# EAGLE design blitz_rev_C (EAGLE 6.5.0)

## Sheet 1 of 6
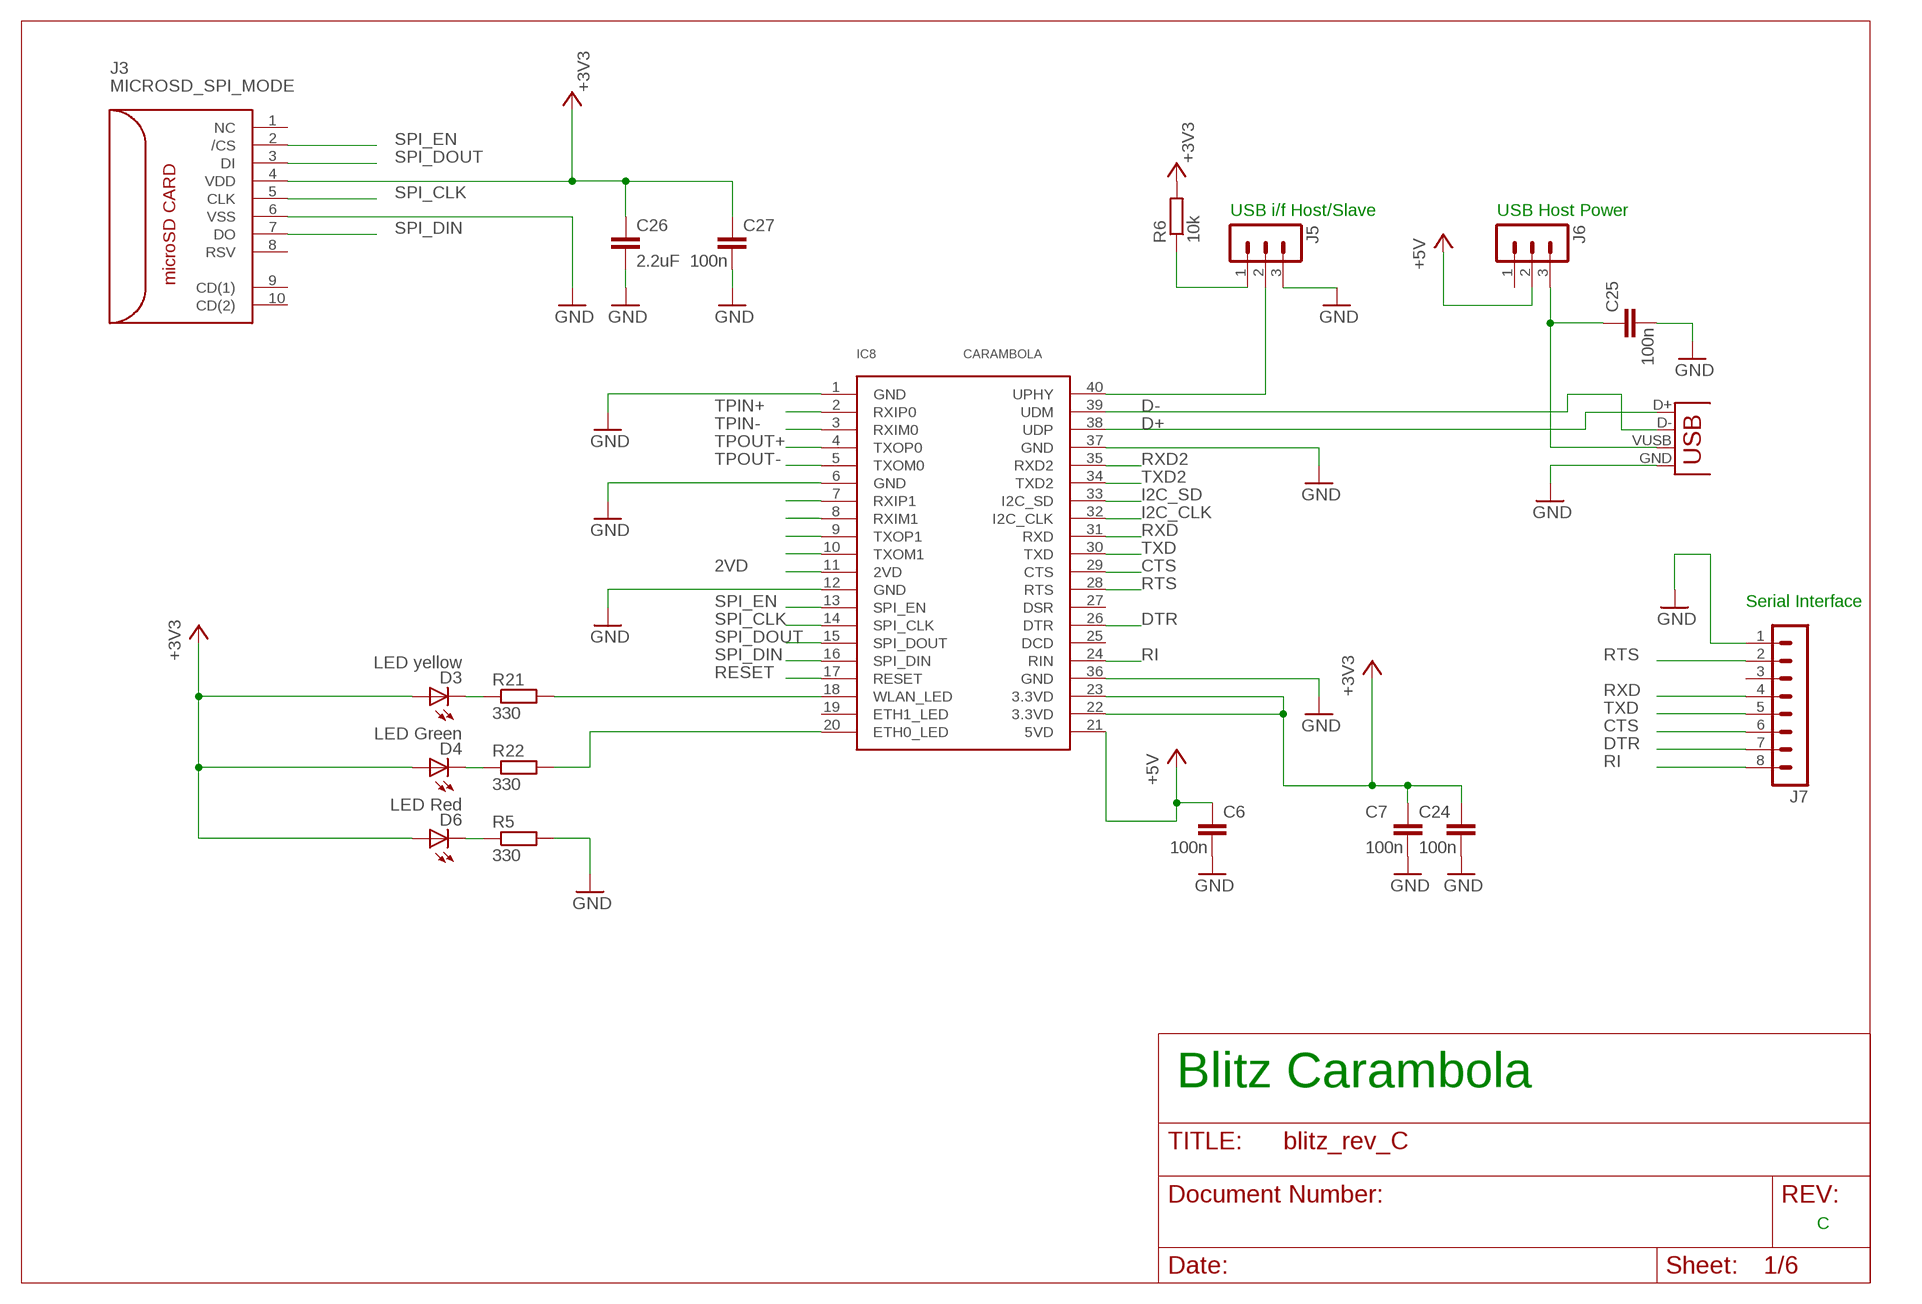
[diagram p0: schematic, sheet 1]

### Parts
C6  100n  C-EUC0805  [C0805]
C7  100n  C-EUC0805  [C0805]
C24  100n  C-EUC0805  [C0805]
C25  100n  C-EUC0805  [C0805]
C26  2.2uF  C-EUC2012  [C2012]
C27  100n  C-EUC0805  [C0805]
D3  LED yellow  LED_2012  [C2012]
D4  LED Green  LED_2012  [C2012]
D6  LED Red  LED_2012  [C2012]
IC8  CARAMBOLA  [CARAMBOLA]
J3  MICROSD_SPI_MODE  [MICRO_SD_CONNECTOR]
J4  USB-B-S  [USB-B-SMT]
J5  MA03-1  [MA03-1]
J6  MA03-1  [MA03-1]
J7  MA08-1  [MA08-1]
R5  330  R-EU_M0805  [M0805]
R6  10k  R-EU_M0805  [M0805]
R21  330  R-EU_M0805  [M0805]
R22  330  R-EU_M0805  [M0805]

### Nets
2VD: IC8.11(2VD)
+3V3: C7.1 C24.1 C26.1 C27.1 D3.1(A) D4.1(A) D6.1(A) IC8.22(3.3VD) IC8.23(3.3VD) J3.4(VDD) R6.2 ; also sheet 2,3,4,5,6
+5V: C6.1 IC8.21(5VD) J6.2 ; also sheet 2,6
CTS: IC8.29(CTS) J7.6
D+: IC8.38(UDP) J4.D+
D-: IC8.39(UDM) J4.D-
DTR: IC8.26(DTR) J7.7
GND: C6.2 C7.2 C24.2 C25.2 C26.2 C27.2 IC8.1(GND) IC8.6(GND) IC8.12(GND) IC8.36(GND) IC8.37(GND) J3.6(VSS) J4.GND J5.3 J7.1 R5.2 ; also sheet 2,3,4,5,6
I2C_CLK: IC8.32(I2C_CLK)
I2C_SD: IC8.33(I2C_SD)
N$7: J5.1 R6.1
N$8: C25.1 J4.VUSB(VBUS) J6.3
N$12: D4.2(C) R22.1
N$16: D3.2(C) R21.1
N$23: IC8.7(RXIP1)
N$24: IC8.8(RXIM1)
N$25: IC8.9(TXOP1)
N$26: IC8.10(TXOM1)
N$28: IC8.18(WLAN_LED) R21.2
N$29: IC8.20(ETH0_LED) R22.2
N$30: D6.2(C) R5.1
N$35: IC8.40(UPHY) J5.2
RESET: IC8.17(RESET)
RI: IC8.24(RIN) J7.8
RTS: IC8.28(RTS) J7.2
RXD: IC8.31(RXD) J7.4
RXD2: IC8.35(RXD2) ; also sheet 3
SPI_CLK: IC8.14(SPI_CLK) J3.5(CLK)
SPI_DIN: IC8.16(SPI_DIN) J3.7(DO)
SPI_DOUT: IC8.15(SPI_DOUT) J3.3(DI)
SPI_EN: IC8.13(SPI_EN) J3.2(/CS)
TPIN+: IC8.2(RXIP0) ; also sheet 4
TPIN-: IC8.3(RXIM0) ; also sheet 4
TPOUT+: IC8.4(TXOP0) ; also sheet 4
TPOUT-: IC8.5(TXOM0) ; also sheet 4
TXD: IC8.30(TXD) J7.5
TXD2: IC8.34(TXD2) ; also sheet 3
Unconnected: IC8.19(ETH1_LED) IC8.25(DCD) IC8.27(DSR) J3.1(NC) J3.8(RSV) J3.9(CD(1)) J3.10(CD(2)) J6.1 J7.3

### Notes on the sheet
- USB i/f Host/Slave | USB Host Power
- Serial Interface
- Blitz Carambola
- C

## Sheet 2 of 6
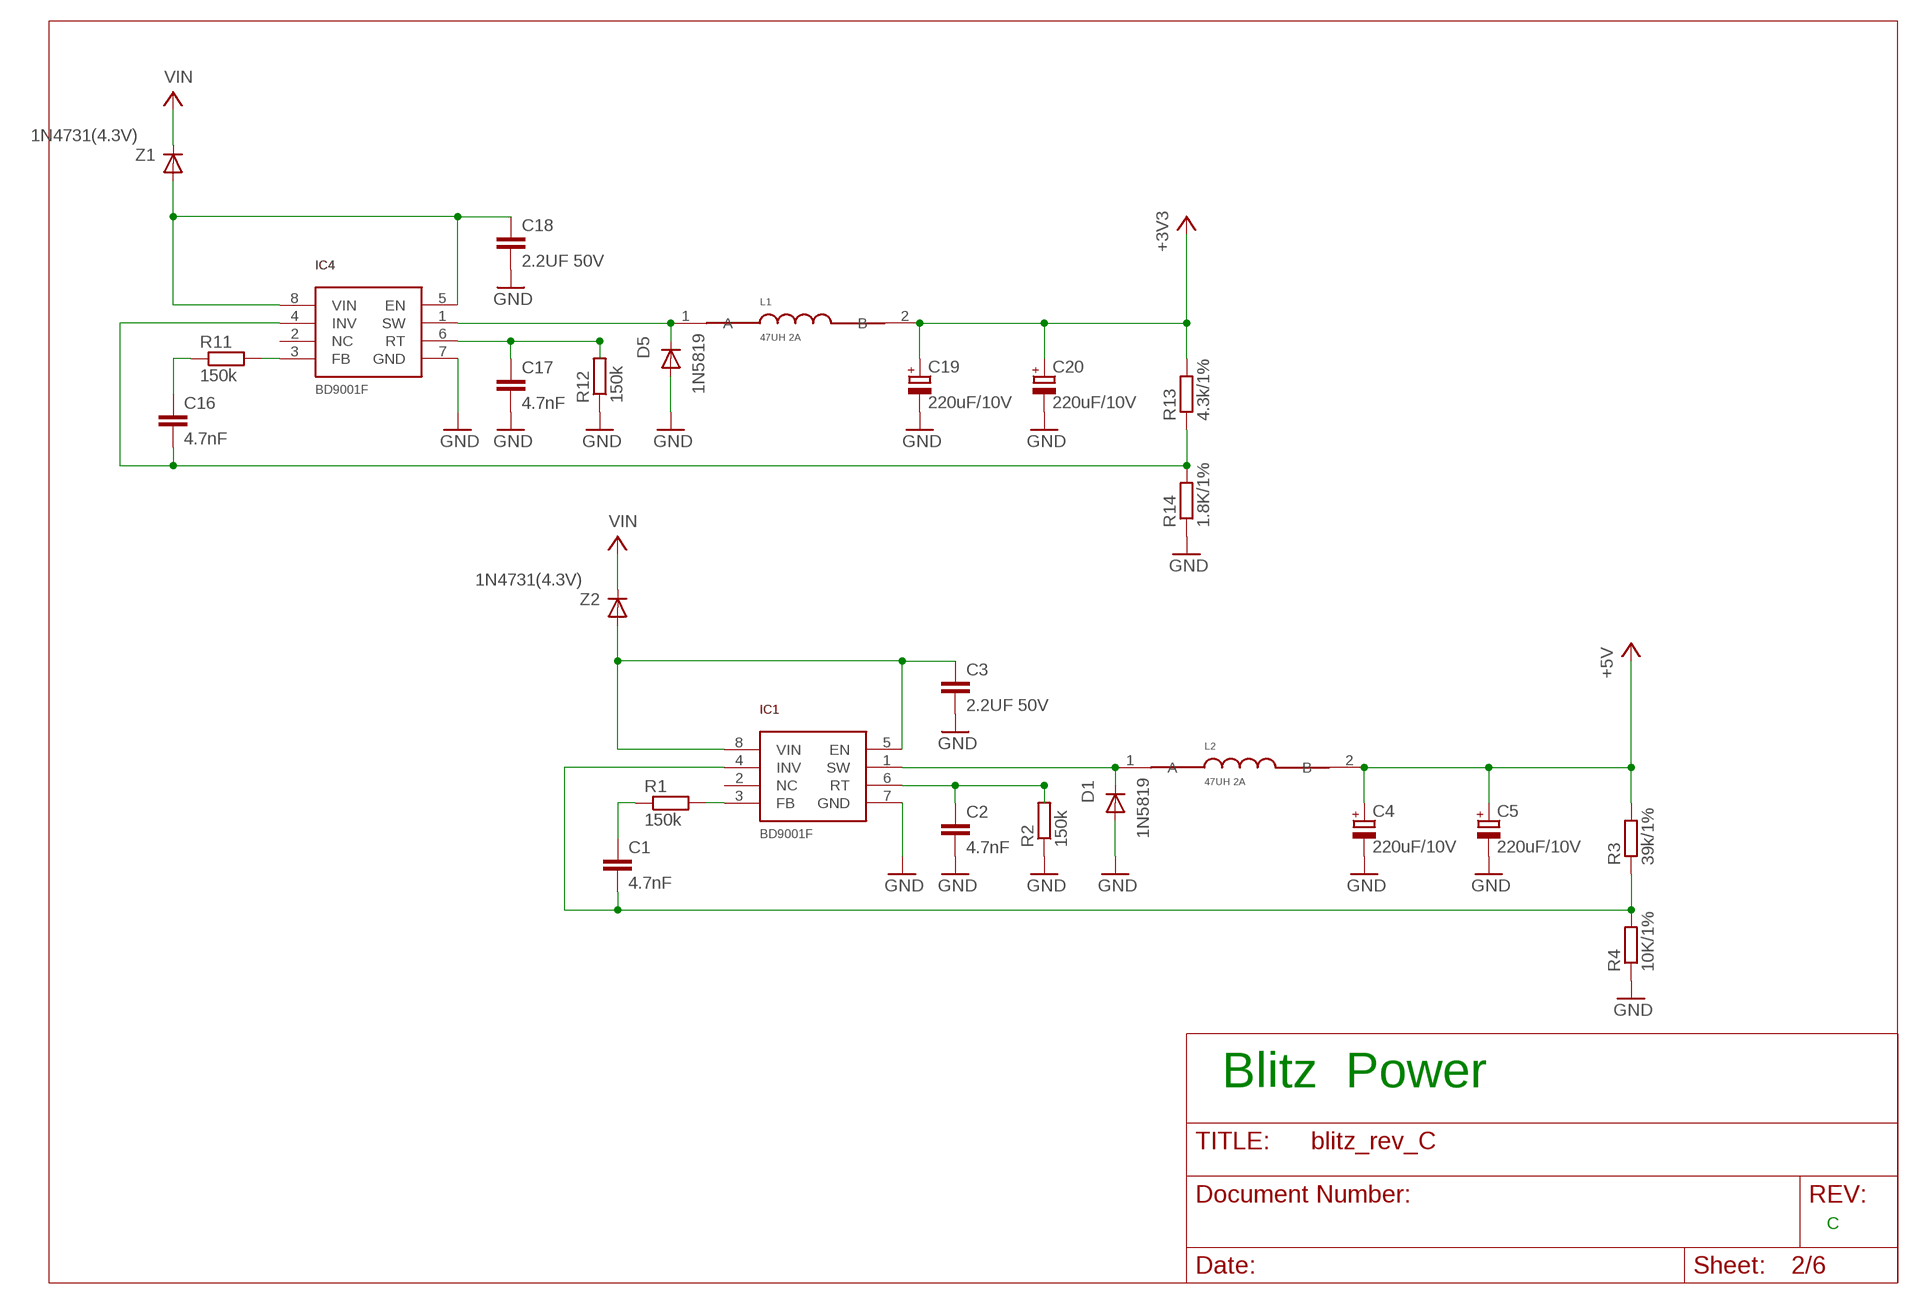
[diagram p1: schematic, sheet 2]

### Parts
C1  4.7nF  C-EUC0805  [C0805]
C2  4.7nF  C-EUC0805  [C0805]
C3  2.2UF 50V  C-EUC2012  [C2012]
C4  220uF/10V  CPOL-EUSMCC  [SMC_C]
C5  220uF/10V  CPOL-EUSMCC  [SMC_C]
C16  4.7nF  C-EUC0805  [C0805]
C17  4.7nF  C-EUC0805  [C0805]
C18  2.2UF 50V  C-EUC2012  [C2012]
C19  220uF/10V  CPOL-EUSMCC  [SMC_C]
C20  220uF/10V  CPOL-EUSMCC  [SMC_C]
D1  1N5819  [SOD-123]
D5  1N5819  [SOD-123]
IC1  BD9001F  [SOP8]
IC4  BD9001F  [SOP8]
L1  47UH 2A  NR10050T470M  [NR10050T470M]
L2  47UH 2A  NR10050T470M  [NR10050T470M]
R1  150k  R-EU_M0805  [M0805]
R2  150k  R-EU_M0805  [M0805]
R3  39k/1%  R-EU_M0805  [M0805]
R4  10K/1%  R-EU_M0805  [M0805]
R11  150k  R-EU_M0805  [M0805]
R12  150k  R-EU_M0805  [M0805]
R13  4.3k/1%  R-EU_M0805  [M0805]
R14  1.8K/1%  R-EU_M0805  [M0805]
Z1  1N4731(4.3V)  [1N4731]
Z2  1N4731(4.3V)  [1N4731]

### Nets
+3V3: C19.+ C20.+ L1.2(B) R13.2 ; also sheet 1,3,4,5,6
+5V: C4.+ C5.+ L2.2(B) R3.2 ; also sheet 1,6
GND: C2.2 C3.2 C4.- C5.- C17.2 C18.2 C19.- C20.- D1.A D5.A IC1.7(GND) IC4.7(GND) R2.1 R4.1 R12.1 R14.1 ; also sheet 1,3,4,5,6
N$1: IC1.3(FB) R1.2
N$2: C1.1 R1.1
N$3: C1.2 IC1.4(INV) R3.1 R4.2
N$4: C2.1 IC1.6(RT) R2.2
N$5: C3.1 IC1.5(EN) IC1.8(VIN) Z2.A
N$6: D1.C IC1.1(SW) L2.1(A)
N$17: IC4.3(FB) R11.2
N$18: C16.1 R11.1
N$19: C16.2 IC4.4(INV) R13.1 R14.2
N$20: C17.1 IC4.6(RT) R12.2
N$21: C18.1 IC4.5(EN) IC4.8(VIN) Z1.A
N$22: D5.C IC4.1(SW) L1.1(A)
V+: Z1.C Z2.C ; supply symbol labelled VIN ; also sheet 4,5
Unconnected: IC1.2(NC) IC4.2(NC)

### Notes on the sheet
- Blitz  Power
- C

## Sheet 3 of 6
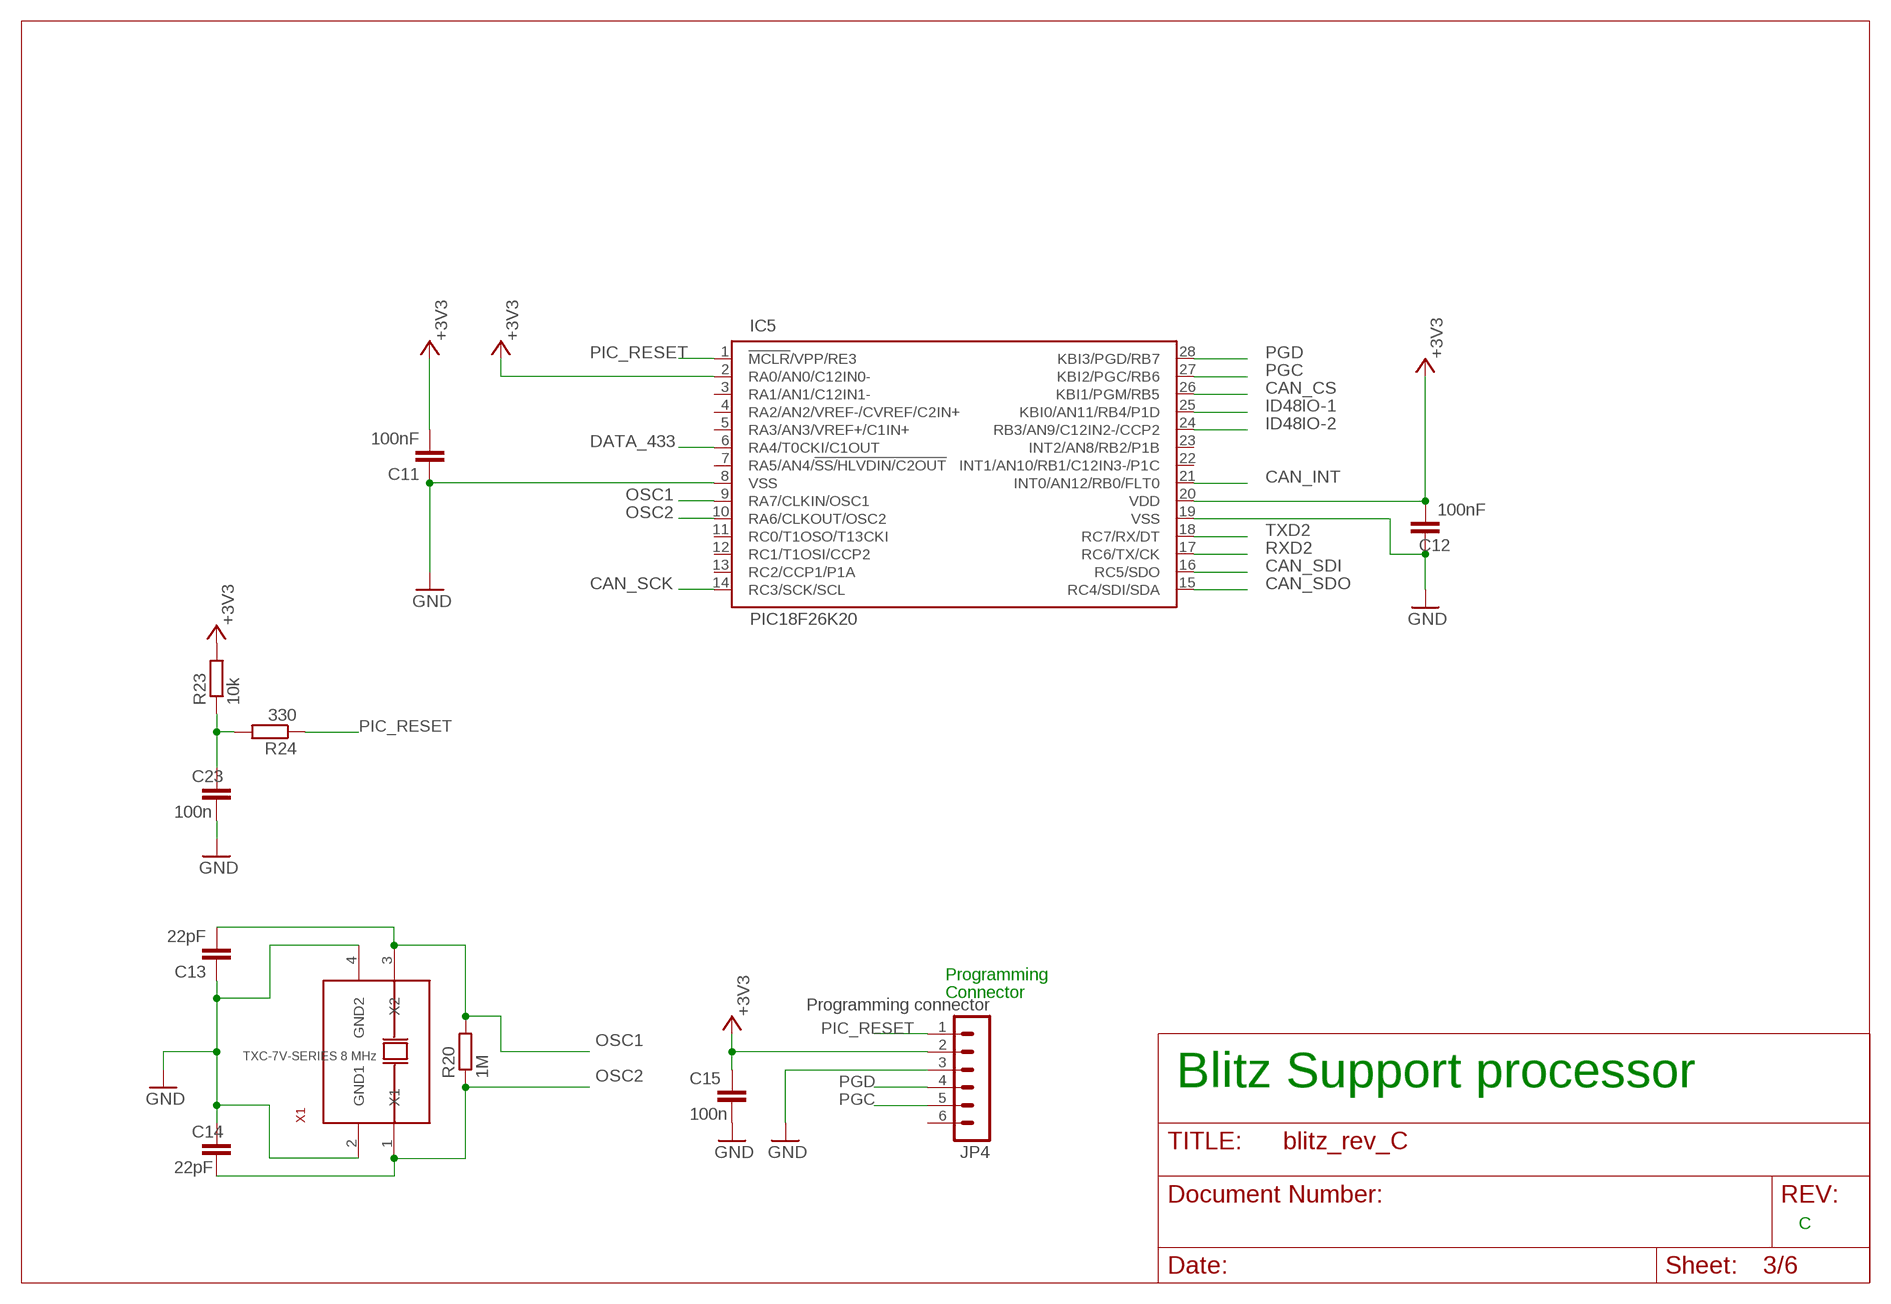
[diagram p2: schematic, sheet 3]

### Parts
C11  100nF  C-EUC0805  [C0805]
C12  100nF  C-EUC0805  [C0805]
C13  22pF  C-EUC0805  [C0805]
C14  22pF  C-EUC0805  [C0805]
C15  100n  C-EUC0805  [C0805]
C23  100n  C-EUC0805  [C0805]
IC5  PIC18F26K20  [SSOP28]
JP4  Programming connector  MA06-1  [MA06-1]
R20  1M  R-EU_M0805  [M0805]
R23  10k  R-EU_M0805  [M0805]
R24  330  R-EU_M0805  [M0805]
X1  TXC-7V-SERIES 8 MHz  TXC-7V-SERIES  [TXC-7V-SERIES]

### Nets
+3V3: C11.2 C12.2 C15.1 IC5.2(RA0/AN0/C12IN0-) IC5.20(VDD) JP4.2 R23.2 ; also sheet 1,2,4,5,6
CAN_CS: IC5.26(KBI1/PGM/RB5) ; also sheet 5
CAN_INT: IC5.21(INT0/AN12/RB0/FLT0) ; also sheet 5
CAN_SCK: IC5.14(RC3/SCK/SCL) ; also sheet 5
CAN_SDI: IC5.16(RC5/SDO) ; also sheet 5
CAN_SDO: IC5.15(RC4/SDI/SDA) ; also sheet 5
DATA_433: IC5.6(RA4/T0CKI/C1OUT) ; also sheet 6
GND: C11.1 C12.1 C13.1 C14.1 C15.2 C23.2 IC5.8(VSS) IC5.19(VSS) JP4.3 X1.2(GND1) X1.4(GND2) ; also sheet 1,2,4,5,6
ID48IO-1: IC5.25(KBI0/AN11/RB4/P1D) ; also sheet 6
ID48IO-2: IC5.24(RB3/AN9/C12IN2-/CCP2) ; also sheet 6
N$13: C23.1 R23.1 R24.2
OSC1: C13.2 IC5.9(RA7/CLKIN/OSC1) R20.2 X1.3(X2)
OSC2: C14.2 IC5.10(RA6/CLKOUT/OSC2) R20.1 X1.1(X1)
PGC: IC5.27(KBI2/PGC/RB6) JP4.5
PGD: IC5.28(KBI3/PGD/RB7) JP4.4
PIC_RESET: IC5.1(!MCLR!/VPP/RE3) JP4.1 R24.1
RXD2: IC5.17(RC6/TX/CK) ; also sheet 1
TXD2: IC5.18(RC7/RX/DT) ; also sheet 1
Unconnected: IC5.3(RA1/AN1/C12IN1-) IC5.4(RA2/AN2/VREF-/CVREF/C2IN+) IC5.5(RA3/AN3/VREF+/C1IN+) IC5.7(RA5/AN4/!SS/HLVDIN/C2OUT) IC5.11(RC0/T1OSO/T13CKI) IC5.12(RC1/T1OSI/CCP2) IC5.13(RC2/CCP1/P1A) IC5.22(INT1/AN10/RB1/C12IN3-/P1C) IC5.23(INT2/AN8/RB2/P1B) JP4.6

### Notes on the sheet
- Programming
- Connector
- Blitz Support processor
- C

## Sheet 4 of 6
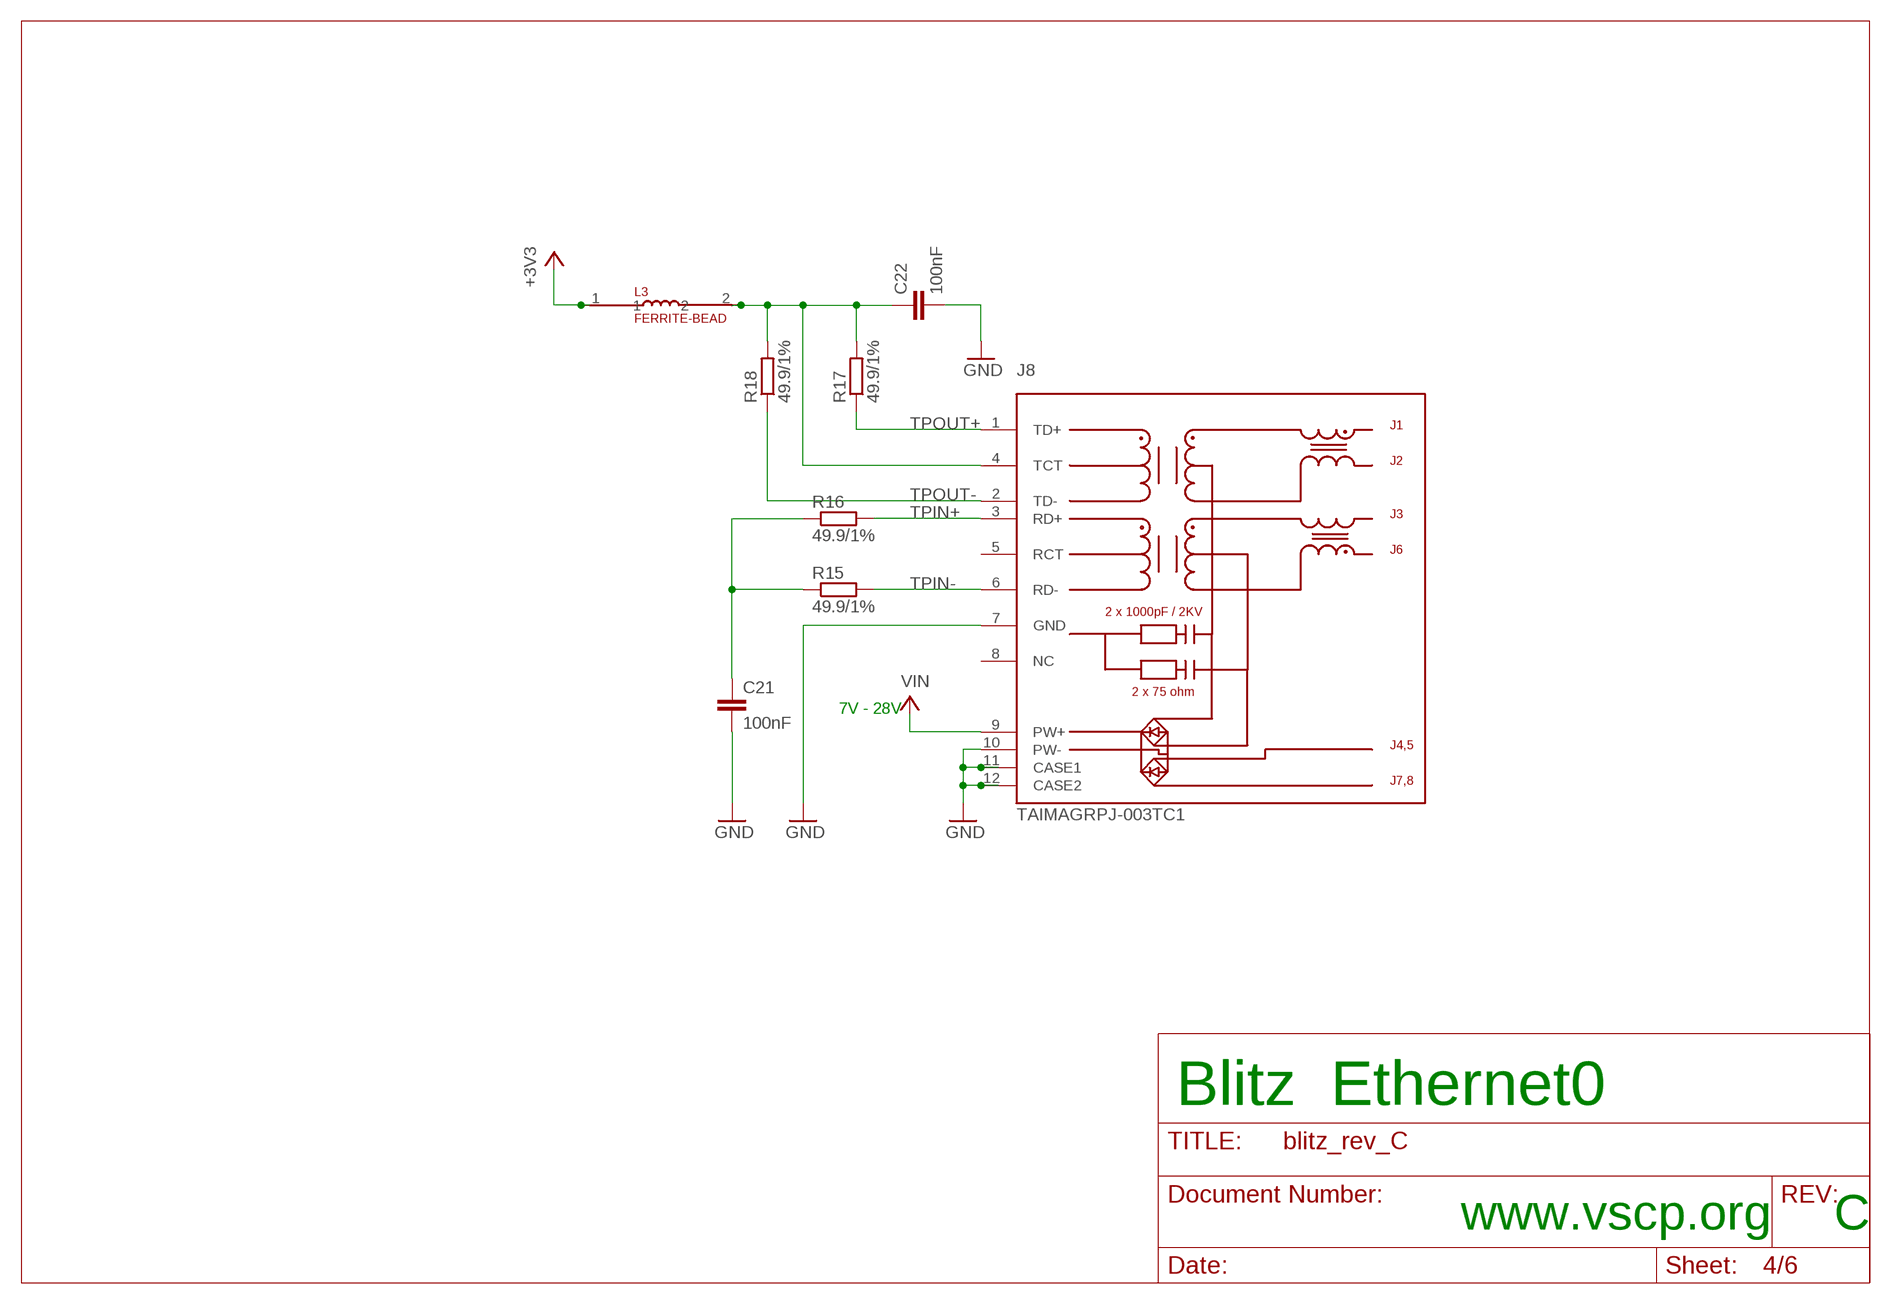
[diagram p3: schematic, sheet 4]

### Parts
C21  100nF  C-EUC0805  [C0805]
C22  100nF  C-EUC0805  [C0805]
J8  TAIMAGRPJ-003TC1  [TAIMAGRJP-003TC1]
L3  FERRITE-BEAD  [0805]
R15  49.9/1%  R-EU_M0805  [M0805]
R16  49.9/1%  R-EU_M0805  [M0805]
R17  49.9/1%  R-EU_M0805  [M0805]
R18  49.9/1%  R-EU_M0805  [M0805]

### Nets
+3V3: L3.1 ; also sheet 1,2,3,5,6
GND: C21.2 C22.2 J8.7(GND) J8.10(PW-) J8.11(CASE1) J8.12(CASE2) ; also sheet 1,2,3,5,6
N$27: C21.1 R15.1 R16.1
N$31: C22.1 J8.4(TCT) L3.2 R17.2 R18.2
TPIN+: J8.3(RD+) R16.2 ; also sheet 1
TPIN-: J8.6(RD-) R15.2 ; also sheet 1
TPOUT+: J8.1(TD+) R17.1 ; also sheet 1
TPOUT-: J8.2(TD-) R18.1 ; also sheet 1
V+: J8.9(PW+) ; supply symbol labelled VIN ; also sheet 2,5
Unconnected: J8.5(RCT) J8.8(NC)

### Notes on the sheet
- 7V - 28V
- Blitz  Ethernet0
- www.vscp.org | C

## Sheet 5 of 6
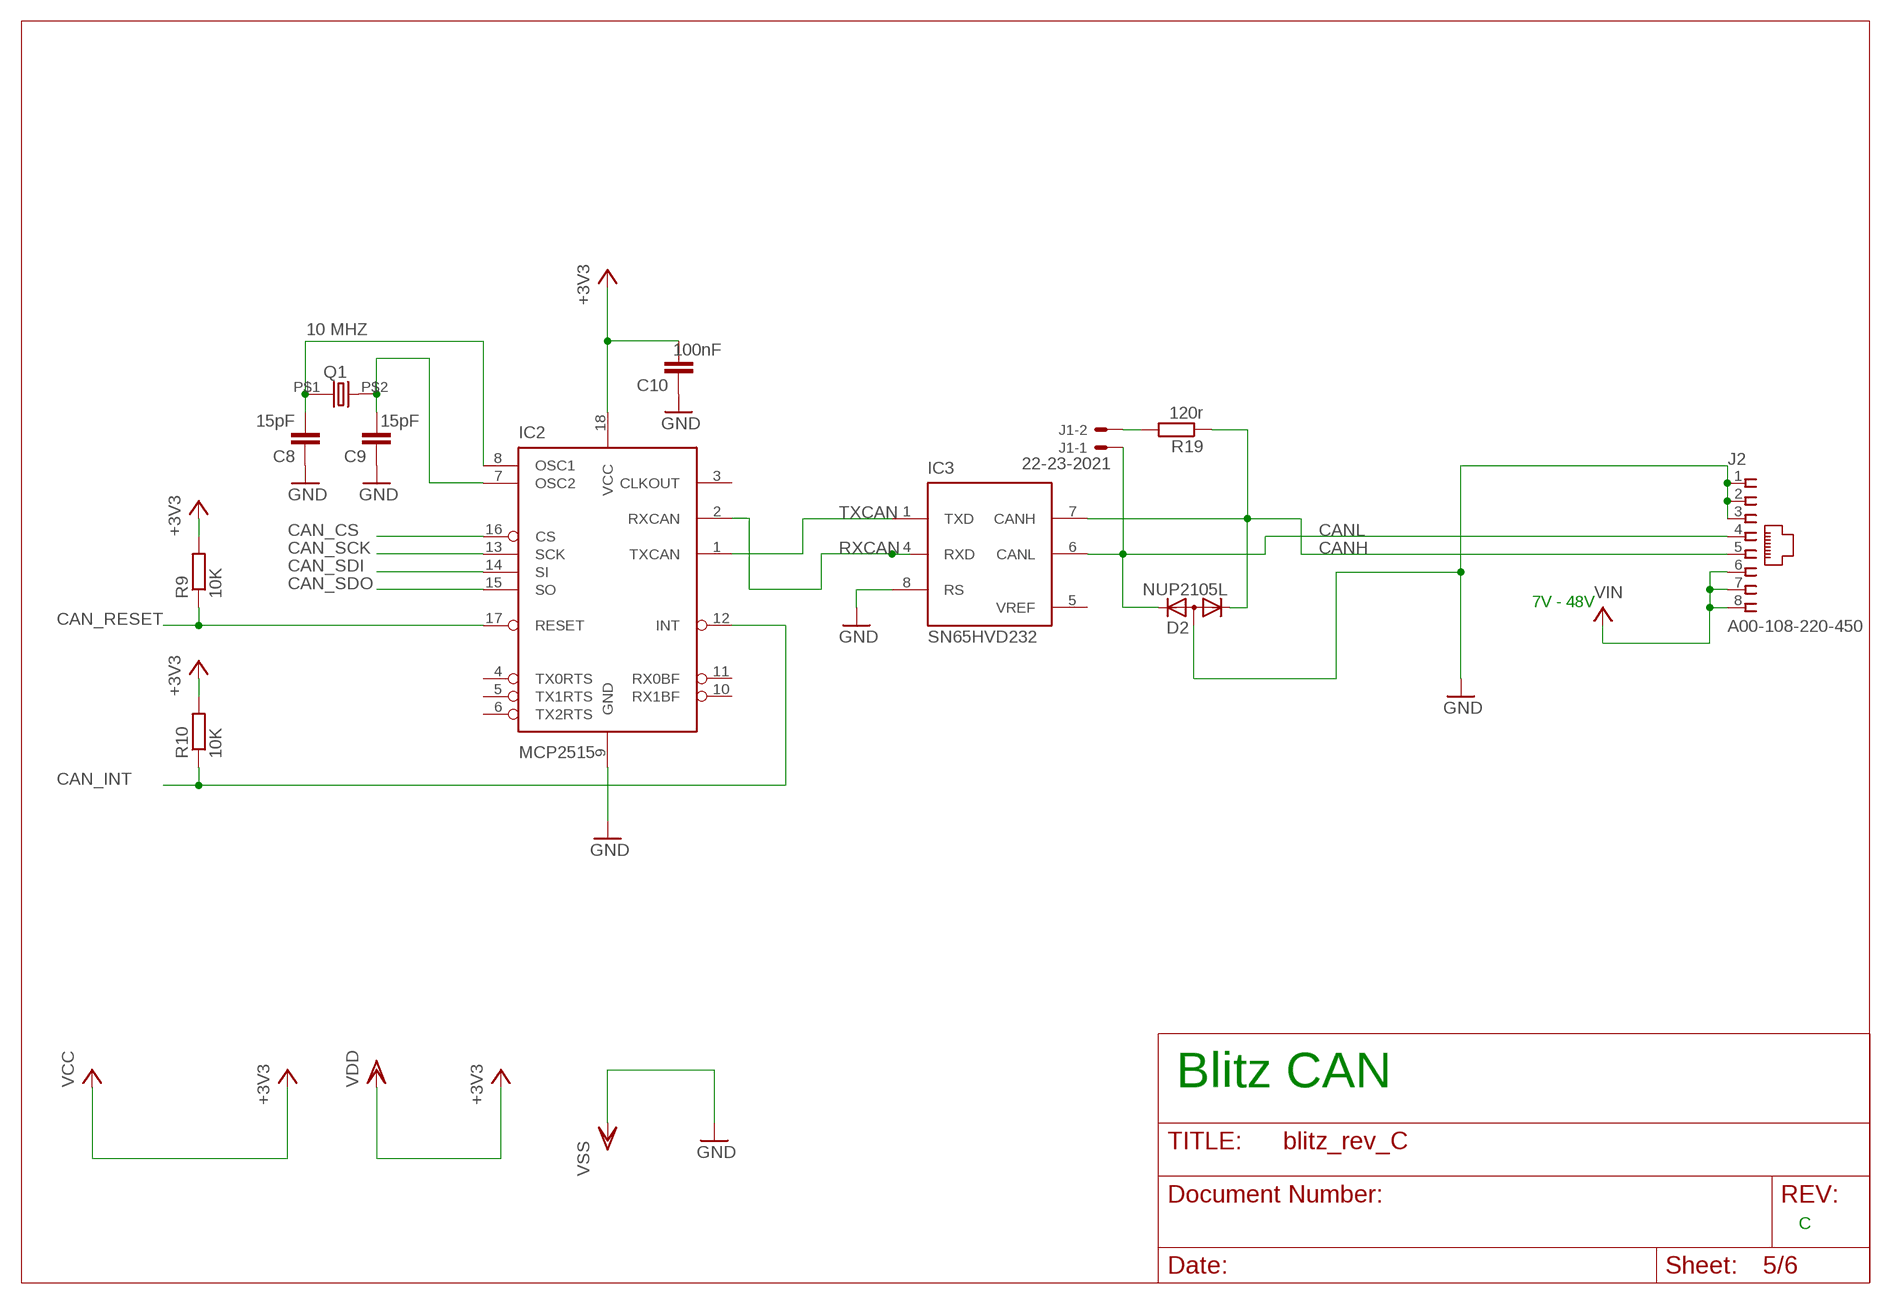
[diagram p4: schematic, sheet 5]

### Parts
C8  15pF  C-EUC0805  [C0805]
C9  15pF  C-EUC0805  [C0805]
C10  100nF  C-EUC0805  [C0805]
D2  NUP2105L  DIODE-2CA|ACSOT23  [SOT23]
IC2  MCP2515  [SO-18W]
IC3  SN65HVD232  MCP2551SN  [SO-08]
J1  22-23-2021  [22-23-2021]
J2  A00-108-220-450  [RJ-45]
Q1  10 MHZ  HC-49S  [9C]
R9  10K  R-EU_R0805  [R0805]
R10  10K  R-EU_R0805  [R0805]
R19  120r  R-EU_R0805  [R0805]

### Nets
+3V3: C10.2 IC2.18(VCC) R9.2 R10.2 ; supply symbol labelled VCC, VDD ; also sheet 1,2,3,4,6
CAN_CS: IC2.16(CS) ; also sheet 3
CAN_INT: IC2.12(INT) R10.1 ; also sheet 3
CAN_RESET: IC2.17(RESET) R9.1
CAN_SCK: IC2.13(SCK) ; also sheet 3
CAN_SDI: IC2.14(SI) ; also sheet 3
CAN_SDO: IC2.15(SO) ; also sheet 3
CANH: D2.1(K1) IC3.7(CANH) J2.5 R19.1
CANL: D2.2(K2) IC3.6(CANL) J1.1 J2.4
GND: C8.1 C9.1 C10.1 D2.3(A) IC2.9(GND) IC3.8(RS) J2.1 J2.2 J2.3 ; supply symbol labelled VSS ; also sheet 1,2,3,4,6
N$9: C8.2 IC2.8(OSC1) Q1.P$1
N$10: C9.2 IC2.7(OSC2) Q1.P$2
N$11: J1.2 R19.2
RXCAN: IC2.2(RXCAN) IC3.4(RXD)
TXCAN: IC2.1(TXCAN) IC3.1(TXD)
V+: J2.6 J2.7 J2.8 ; supply symbol labelled VIN ; also sheet 2,4
Unconnected: IC2.3(CLKOUT) IC2.4(TX0RTS) IC2.5(TX1RTS) IC2.6(TX2RTS) IC2.10(RX1BF) IC2.11(RX0BF)

### Notes on the sheet
- 7V - 48V
- Blitz CAN
- C

## Sheet 6 of 6
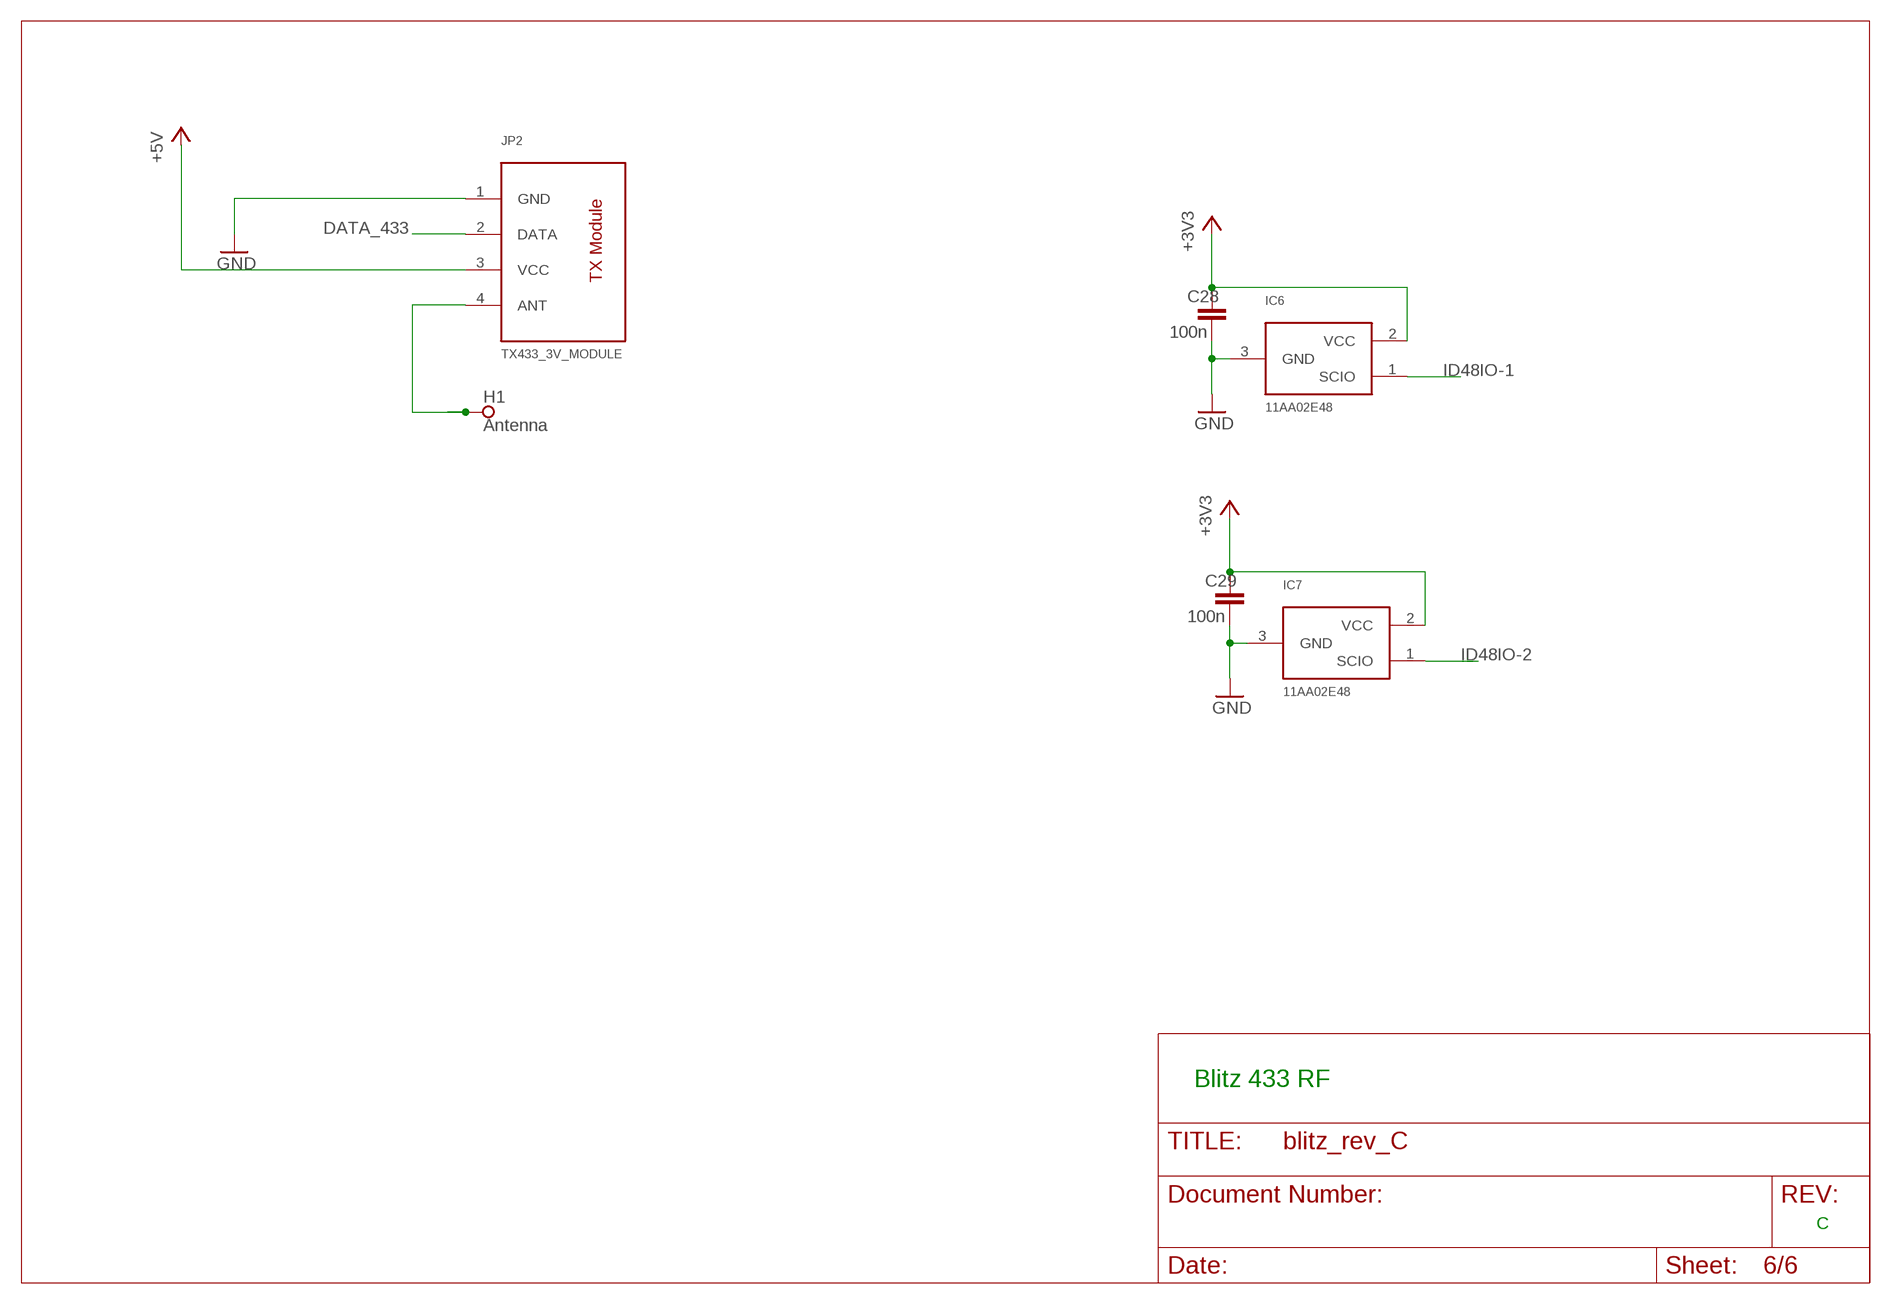
[diagram p5: schematic, sheet 6]

### Parts
C28  100n  C-EUC0805  [C0805]
C29  100n  C-EUC0805  [C0805]
H1  Antenna  SPECIAL_DRILL_0.1000  [PAD_0.1000]
IC6  11AA02E48  [SOT23]
IC7  11AA02E48  [SOT23]
JP2  TX433_3V_MODULE  [FOUR]

### Nets
+3V3: C28.1 C29.1 IC6.2(VCC) IC7.2(VCC) ; also sheet 1,2,3,4,5
+5V: JP2.3(VCC) ; also sheet 1,2
ANT: H1.1 JP2.4(ANT)
DATA_433: JP2.2(DATA) ; also sheet 3
GND: C28.2 C29.2 IC6.3(GND) IC7.3(GND) JP2.1(GND) ; also sheet 1,2,3,4,5
ID48IO-1: IC6.1(SCIO) ; also sheet 3
ID48IO-2: IC7.1(SCIO) ; also sheet 3

### Notes on the sheet
- Blitz 433 RF
- C

## Power pins joined to a net without a drawn wire
+3V3: IC3.3(VDD)
GND: IC3.2(VSS)
VREF: IC3.5(VREF)

## Library data of the parts
C1-C3 C6-C18 C21-C29 = rcl:C-EU: CAPACITOR, European symbol
C4 C5 C19 C20 = rcl:CPOL-EU: POLARIZED CAPACITOR, European symbol
D1 D5 = snow:1N5819
D2 = diode:DIODE-2CA|AC: Dual DIODE Cathode-Anode|Anode-Cathode
D3 D4 D6 = snow:LED_2012
H1 = special-drill:SPECIAL_DRILL_: Special drills
IC1 IC4 = snow:BD9001F
IC2 = vscpcan:MCP2515
IC3 = microchip_can:MCP2551: High Speed CAN tranceiver
IC5 = miwi:PIC18F26K20
IC6 IC7 = snow:11AA02E48
IC8 = carambola:CARAMBOLA
J1 = con-molex:22-23-2021: .100" (2.54mm) Center Header - 2 Pin; MF: MOLEX; MPN: 22-23-2021; OC_FARNELL: 1462926; OC_NEWARK: 25C3832
J2 = vscpcan:A00-108-220-450
J3 = con-molex-microsd:MICROSD_SPI_MODE: MOLEX - 49225-0821 - CONNECTEUR MICRO SD PUSH/PUSH REV Fabricant: MOLEX Code commande Farnell: 1366700 <http://fr.farnell.com/molex/49225-0821/connecteur-micro-sd-push-push-rev/dp/1366700?Ntt=1366700> Référence fabricant: 49225-0821
J4 = con-usb:USB: USB Connectors
J5 J6 = con-lstb:MA03-1: PIN HEADER; OC_FARNELL: unknown; OC_NEWARK: unknown
J7 = con-lstb:MA08-1: PIN HEADER; OC_FARNELL: unknown; OC_NEWARK: unknown
J8 = snow:TAIMAGRPJ-003TC1
JP2 = miwi:TX433_3V_MODULE
JP4 = con-lstb:MA06-1: PIN HEADER; OC_FARNELL: unknown; OC_NEWARK: unknown
L1 L2 = snow:NR10050T470M
L3 = snow:FERRITE-BEAD
Q1 = vscpcan:HC-49S: Digikey 887-1050-1-nd
R1-R6 R9-R24 = rcl:R-EU_: RESISTOR, European symbol
X1 = snow:TXC-7V-SERIES
Z1 Z2 = snow:1N4731(4.3V)

## Board
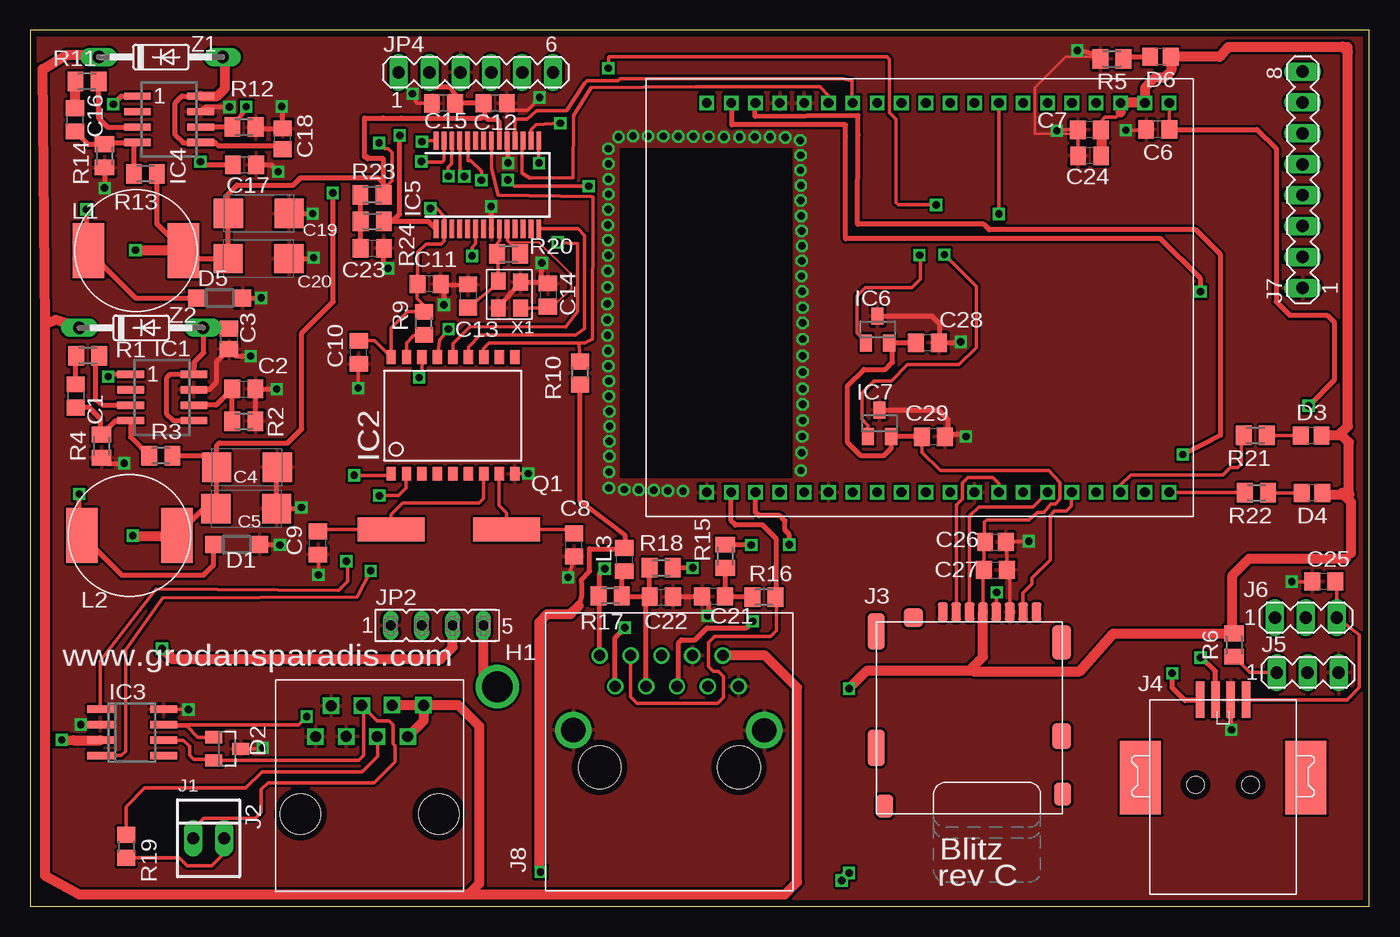
[diagram p6: board, top side]
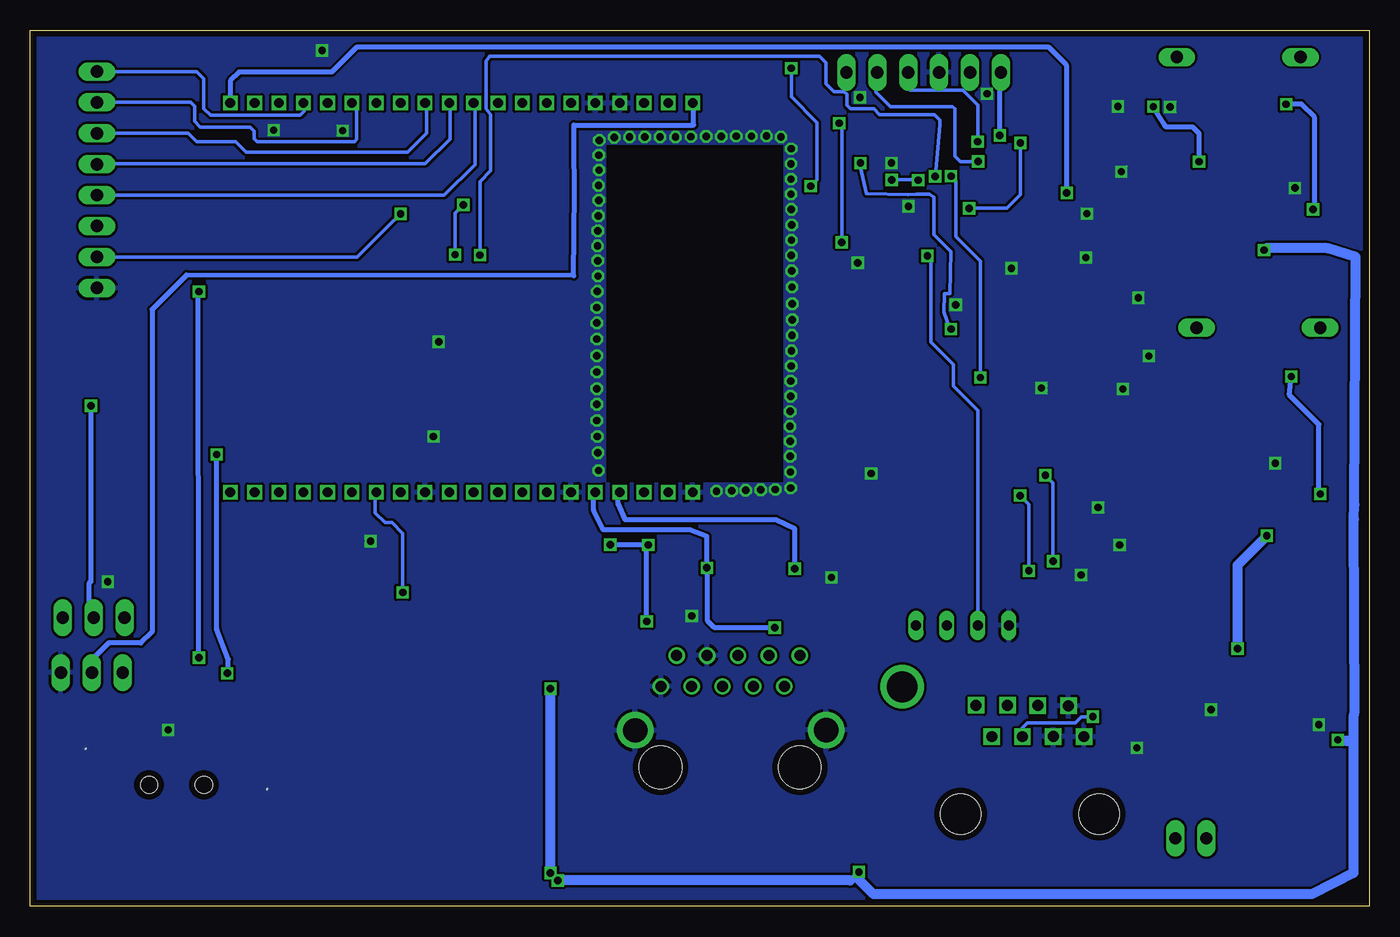
[diagram p7: board, bottom side, seen from below]

Size 110 x 72 mm. Coordinates in mm from the lower left corner, seen from the top.
Outline: 0,0 110,0 110,72 0,72 0,0
Copper layers (1*16): Top 0.035mm / dielectric 1.5mm / Bottom 0.035mm
Design rules "8mils": minimum track width 8mil, minimum drill 0.6mm, track to track 8mil, track to pad 8mil, pad to pad 8mil, via to via 8mil, smd to smd 0mil, copper to edge 20mil, drill to drill 10mil, minimum pad ring 8mil, minimum via ring 8mil, stop-mask expansion 0mil, vias tented up to drill 0mil, thermal gap 10mil
tRestrict: area 48.5,35.2 to 62.6,62.3
bRestrict: area 48.1,34.9 to 62.7,62.6; area 48.2,34.9 to 62.7,62.5

### Footprints (pad centres in the part's own frame; a part is rotated, then mirrored left to right if it is on the bottom)
C0805 = smd 1.3 x 1.5: 1 -0.95,0; 2 0.95,0
C2012 = smd 1.3 x 1.5: 1 -0.85,0; 2 0.85,0
SMC_C = smd 2.4 x 2.4: + -2.5,0; - 2.5,0
SOD-123 = smd 1.4 x 1.4: A 1.9,0; C -1.9,0
SOT23 = smd 1 x 1.4: 1 -0.95,-1.1; 2 0.95,-1.1; 3 0,1.1
PAD_0.1000 = drill 2.54 pad 2.54: 1 0,0
SOP8 = smd 0.6 x 2.2: 1 -1.905,-2.6; 2 -0.635,-2.6; 3 0.635,-2.6; 4 1.905,-2.6; 5 1.905,2.6; 6 0.635,2.6; 7 -0.635,2.6; 8 -1.905,2.6
SO-18W = smd 0.762 x 1.143: 1 -5.08,-4.788; 2 -3.81,-4.788; 3 -2.54,-4.788; 4 -1.27,-4.788; 5 0,-4.788; 6 1.27,-4.788; 7 2.54,-4.788; 8 3.81,-4.788; 9 5.08,-4.788; 10 5.08,4.788; 11 3.81,4.788; 12 2.54,4.788; 13 1.27,4.788; 14 0,4.788; 15 -1.27,4.788; 16 -2.54,4.788; 17 -3.81,4.788; 18 -5.08,4.788
SO-08 = smd 0.6 x 2.2: 1 -1.905,-2.6; 2 -0.635,-2.6; 3 0.635,-2.6; 4 1.905,-2.6; 5 1.905,2.6; 6 0.635,2.6; 7 -0.635,2.6; 8 -1.905,2.6
SSOP28 = smd 0.4 x 1.5: 1 -4.225,-3.625; 2 -3.575,-3.625; 3 -2.925,-3.625; 4 -2.275,-3.625; 5 -1.625,-3.625; 6 -0.975,-3.625; 7 -0.325,-3.625; 8 0.325,-3.625; 9 0.975,-3.625; 10 1.625,-3.625; 11 2.275,-3.625; 12 2.925,-3.625; 13 3.575,-3.625; 14 4.225,-3.625; 15 4.225,3.625; 16 3.575,3.625; 17 2.925,3.625; 18 2.275,3.625; 19 1.625,3.625; 20 0.975,3.625; 21 0.325,3.625; 22 -0.325,3.625; 23 -0.975,3.625; 24 -1.625,3.625; 25 -2.275,3.625; 26 -2.925,3.625; 27 -3.575,3.625; 28 -4.225,3.625
CARAMBOLA = drill 0.8 square: 1 16,-20; 2 16,-18; 3 16,-16; 4 16,-14; 5 16,-12; 6 16,-10; 7 16,-8; 8 16,-6; 9 16,-4; 10 16,-2; 11 16,0; 12 16,2; 13 16,4; 14 16,6; 15 16,8; 16 16,10; 17 16,12; 18 16,14; 19 16,16; 20 16,18; 21 -16,18; 22 -16,16; 23 -16,14; 24 -16,12; 25 -16,10; 26 -16,8; 27 -16,6; 28 -16,4; 29 -16,2; 30 -16,0; 31 -16,-2; 32 -16,-4; 33 -16,-6; 34 -16,-8; 35 -16,-10; 36 -16,-12; 37 -16,-14; 38 -16,-16; 39 -16,-18; 40 -16,-20
22-23-2021 = drill 1 long: 1 -1.27,0; 2 1.27,0
RJ-45 = drill 0.9 square: 1 -4.45,6.35; 2 -3.17,8.89; 3 -1.92,6.36; 4 -0.65,8.91; 5 0.62,6.35; 6 1.84,8.93; 7 3.14,6.35; 8 4.42,8.93 | hole 3.3: -5.7,0; 5.7,0
MICRO_SD_CONNECTOR = smd 0.8 x 1.6: 1 -2.03,8.2; 2 -0.93,8.2; 3 0.17,8.2; 4 1.27,8.2; 5 2.37,8.2; 6 3.47,8.2; 7 4.57,8.2; 8 5.67,8.2 | smd 1.55 x 2.8: 9 7.735,5.7 | smd 1.55 x 2.1: 10 7.735,-2 | smd 1.4 x 1.9: 11 7.81,-6.75; 12 -6.79,-7.75 | smd 1.4 x 3: 13 -7.49,-2.95; 14 -7.49,6.6 | smd 1.6 x 1.55: 15 -4.43,7.725
USB-B-SMT = smd 6.04 x 3.4: 5 0.58,6.8; 6 0.58,-6.8 | smd 3 x 0.7: D+ 7,1.875; D- 7,0.625; GND 7,-0.625; VUSB 7,-1.875 | hole 1.4: 0,2.25; 0,-2.25
MA03-1 = drill 1.016 long: 1 -2.54,0; 2 0,0; 3 2.54,0
MA08-1 = drill 1.016 long: 1 -8.89,0; 2 -6.35,0; 3 -3.81,0; 4 -1.27,0; 5 1.27,0; 6 3.81,0; 7 6.35,0; 8 8.89,0
TAIMAGRJP-003TC1 = drill 0.9: 1 -5.72,9.2; 2 -4.45,6.66; 3 -3.18,9.2; 4 -1.91,6.66; 5 -0.64,9.2; 6 0.63,6.66; 7 1.9,9.2; 8 3.17,6.66; 9 4.4,9.2; 10 5.7,6.66 | drill 2: 11 -7.88,3.07; 12 7.81,3.05 | hole 3.5: -5.72,0; 5.72,0
FOUR = drill 0.813 long: 1 2.54,0; 2 5.08,0; 3 7.62,0; 4 10.16,0
MA06-1 = drill 1.016 long: 1 -6.35,0; 2 -3.81,0; 3 -1.27,0; 4 1.27,0; 5 3.81,0; 6 6.35,0
NR10050T470M = smd 2.6 x 4.5: 1 -3.9,0; 2 3.9,0
0805 = smd 1.3 x 1.5: 1 -0.95,0; 2 0.95,0
9C = smd 5.5 x 2: P$1 -4.74,0; P$2 4.76,0
M0805 = smd 1.3 x 1.6: 1 -0.95,0; 2 0.95,0
R0805 = smd 1.3 x 1.5: 1 -0.95,0; 2 0.95,0
TXC-7V-SERIES = smd 1.4 x 1.2: 1 -1.07,-0.67; 2 1.07,-0.67; 3 1.13,1.17; 4 -1.07,1.17
1N4731 = drill 1 long: A 5.08,0; C -5.08,0

### Placement (x,y rotation side)
C1  3.72,41.97 270 top
C2  17.54,42.54 0 top
C3  16.31,46.65 270 top
C4  17.79,36.11 0 top
C5  17.74,32.69 0 top
C6  92.63,63.86 180 top
C7  87.02,63.83 180 top
C8  44.66,29.71 90 top
C9  23.62,29.87 90 top
C10  26.99,45.55 90 top
C11  32.77,51.16 180 top
C12  38.19,66.01 180 top
C13  35.97,50.17 270 top
C14  42.52,50.26 270 top
C15  33.94,66.01 180 top
C16  3.65,64.65 270 top
C17  17.59,60.95 0 top
C18  20.73,63.09 90 top
C19  18.76,56.96 0 top
C20  18.75,53.25 0 top
C21  56.13,25.49 180 top
C22  51.84,25.46 0 top
C23  28.09,54.09 0 top
C24  87.03,61.69 180 top
C25  106.27,26.71 180 top
C26  79.3,29.95 0 top
C27  79.3,27.66 0 top
C28  73.72,46.33 0 top
C29  74.2,38.61 0 top
D1  16.95,29.74 0 top
D2  16.17,12.96 270 top
D3  105.24,38.71 180 top
D4  105.31,33.99 180 top
D5  15.55,50.01 0 top
D6  92.86,69.84 180 top
H1  38.37,18.06 0 top
IC1  10.83,41.84 270 top
IC2  34.71,40.35 0 top
IC3  8.35,14.31 270 top
IC4  11.39,64.69 270 top
IC5  37.55,59.31 0 top
IC6  69.61,47.42 0 top
IC7  69.77,39.71 0 top
IC8  75.58,50.04 270 top
J1  14.64,5.61 0 top
J2  27.87,7.61 0 top
J3  77,16 0 top
J4  98,10 90 top
J5  104.95,19.23 0 top
J6  104.8,23.74 0 top
J7  104.54,59.73 90 top
J8  52.5,11.43 0 top
JP2  27.07,23.1 0 top
JP4  36.6,68.55 0 top
L1  8.67,53.9 0 top
L2  8.15,30.48 0 top
L3  48.79,28.51 270 top
Q1  34.39,30.99 180 top
R1  4.71,45.26 0 top
R2  17.54,39.88 180 top
R3  10.72,37.03 0 top
R4  5.85,37.83 90 top
R5  88.87,69.67 180 top
R6  98.89,21.48 90 top
R9  32.34,47.93 90 top
R10  45.15,43.84 270 top
R11  4.65,67.79 0 top
R12  17.55,64.06 180 top
R13  9.45,60.22 0 top
R14  6.09,61.69 90 top
R15  57.08,28.78 90 top
R16  60.28,25.42 0 top
R17  47.65,25.52 0 top
R18  51.83,27.83 180 top
R19  7.87,4.94 270 top
R20  39.29,53.63 180 top
R21  100.65,38.72 180 top
R22  100.75,34 180 top
R23  28.07,58.47 0 top
R24  28.09,56.32 180 top
X1  39.6,50.26 90 top
Z1  10.71,69.82 0 top
Z2  9.1,47.56 0 top

### Tracks (layer width: path | path; a pad name or v marks a point on that pad's centre or on a via)
+3V3  (via drill 0.6)
  Top 0.203: 90.17,66.04 IC8.23 | IC8.22 91.44,66.04
  Top 0.305: R23.2 29.02,58.98 29.71,59.67 29.71,61.96 29.39,62.28 29.14,62.28 v28.66,62.76 | v32.86,57.38 33.37,57.38 34.03,56.71 34.03,55.74 IC5.2 33.97,54.67 33.75,54.45 32.51,54.45 31.82,53.76 C11.2 31.78,51.11 31.78,49.96 32.34,49.4 R9.2 30.98,48.88 29.63,47.53 IC2.18 28.28,46.5 C10.2 | 12.52,53.94 L1.2 | J3.4 78.27,27.58 C27.1 78.35,29.84 C26.1 78.4,30 78.4,31.61 78.58,31.79 82.04,31.79 82.75,32.39 83.29,32.39 83.86,33.07 84.22,33.07 84.57,33.51 84.57,34.86 83.68,35.82 74.76,35.82 73.25,37.33 C29.1 | 77.31,19.55 77.46,19.32 | 87.98,63.81 C7.1 87.92,63.87 87.92,64.47 88.31,64.86 89.18,64.86 89.58,65.25
  Top 0.406: R13.2 10.4,56.06 L1.2 13.21,53.25 C20.+ 16.25,56.94 C19.+ 16.19,57.03 16.19,58.49 16.99,59.29 21.6,59.29 22.2,59.89 28.56,59.89 29.02,59.44 R23.2 29.01,61.45 27.67,61.45 27.67,61.61 27.45,61.61 27.45,64.79 28.95,64.8 29.02,64.8 30.47,64.79 37.06,64.79 37.34,65.08 | IC5.20 38.53,64.5 38.33,64.7 37.57,64.7 37.34,64.92 37.34,65.08 | 37.34,65.08 37.34,65.91 C12.2 C15.1 34.89,66.77 34.5,67.33 33.23,67.33 32.83,67.56 32.83,68.51 JP4.2 | 45.08,24.71 45.32,25.51 45.32,26.37 45.28,26.85 45.96,27.54 45.94,29.38 48.79,29.39 L3.1 48.88,29.54 48.88,30.49 45.15,33.32 R10.2 | v41.92,2.84 41.83,2.93 | 77.16,19.4 77.31,19.55 | 107.52,38.73 106.11,38.73 D3.1 | 108.39,33.87 108.35,33.92 | 106.28,33.87 D4.1 107.77,33.99 | 108.12,28.6 108.53,29.01 | R6.2 98.77,22.55 | D6.1 93.73,69.14 | C28.1 70.58,46.33 IC6.2 70.85,46.04 70.85,44.73 70.25,44.14 68.48,44.14 67.14,42.81 67.14,38.14 68.25,37.03 70.11,37.03 70.72,37.65 IC7.2 C29.1
  Top 0.813: IC3.3 3.53,13.67 v2.58,13.69 | v8.64,53.94 12.52,53.94 | 45.08,24.71 44.39,24.03 42.47,24.03 41.83,23.39 41.83,2.93 | J3.4 78.27,20.51 77.31,19.55 | 77.16,19.4 68.76,19.4 v67.27,17.91 | v66.66,2.14 v67.27,2.75 | R6.2 88.97,22.43 86.24,19.32 77.46,19.32 | 87.98,63.81 C24.1 | IC8.23 89.58,65.25 | D6.1 97.73,69.84 98.41,70.64 108.23,70.64 108.23,70.19 107.84,70.66 108.25,70.25 108.25,39.46 107.52,38.73 | D3.1 107.77,38.71 108.35,38.13 108.35,33.92 | 106.28,33.87 108.39,33.87 | 107.77,33.99 108.53,33.23 108.53,29.01 | 108.12,28.6 100.15,28.6 98.77,27.23 98.77,22.55 | IC8.22 91.58,67.29 92.4,68.11 93.14,68.11 93.73,68.71 93.73,69.14 | 91.44,66.04 90.17,66.04
  Bottom 0.305: v28.66,62.76 28.66,58.52 29.77,57.41 32.83,57.41 v32.86,57.38 | 8.48,54.09 v8.64,53.94
  Bottom 0.406: v41.92,2.84 42.62,2.14
  Bottom 0.813: 8.48,54.09 3.42,54.09 1.1,53.37 1.21,33.01 1.26,31.84 1.18,15.96 1.25,15.76 1.27,13.54 v2.58,13.69 1.27,13.55 1.27,2.75 4.72,1.01 40.73,1.01 41.92,2.2 v41.92,2.84 | v67.27,2.75 v67.27,17.91 | 42.62,2.14 v66.66,2.14
+5V  (via drill 0.6)
  Top 0.305: C6.1 IC8.21
  Top 0.406: R3.2 14.36,37.03 C4.+ | C4.+ 15.29,32.74 C5.+ 14.26,32.69 L2.2 | C4.+ 15.29,37.86 15.52,38.09 21.15,38.09 22.3,39.24 22.3,47.13 24.88,49.71 24.88,58.62 v24.84,58.65 | C6.1 100.81,63.86 102.36,62.31 102.36,49.71 103.47,48.59 106.56,48.59 107.13,48.02 107.13,43.25 v105.03,41.15
  Top 0.813: JP2.3 34.69,21.31 33.71,20.33 11.67,20.33 v10.81,21.19 | v8.4,30.46 12.53,30.46 12.78,30.21 12.32,30.21 L2.2
  Bottom 0.406: v24.84,58.65 24.84,69.09 24.91,69.15 24.91,69.22 26.31,70.61 83.21,70.61 85.25,68.58 92.85,68.58 93.58,67.85 IC8.21 | v105.03,41.15 105.03,26.7 105.19,26.54 105.19,24.13 J6.2
  Bottom 0.813: v10.81,21.19 10.81,28.05 v8.4,30.46
ANT
  Top 0.813: JP2.4 37.23,19.19 H1.1
CAN_CS  (via drill 0.6)
  Top 0.305: IC2.16 32.17,43.71 v31.94,43.47 | v34.35,60.02 34.31,60.76 34.6,61.05 34.64,62.92 IC5.26
  Bottom 0.305: v31.94,43.47 31.94,53.05 33.94,55.05 33.94,59.6 v34.35,60.02
CAN_INT
  Top 0.305: IC2.12 37.25,45.86 37.69,46.3 45.52,46.3 | 45.52,46.3 46.21,46.65 46.23,58.32 46.1,58.32 38.41,58.46 37.88,60.69 IC5.21 | R10.1 45.07,46.28 45.52,46.3
CAN_RESET
  Top 0.305: IC2.17 30.9,46.32 31.49,46.91 32.27,46.91 R9.1
CAN_SCK
  Top 0.305: IC2.13 35.98,45.99 36.96,46.97 44.78,46.97 45.53,47.51 45.53,55.12 45.01,55.72 41.82,55.72 IC5.14
CAN_SDI  (via drill 0.6)
  Top 0.305: IC2.14 34.71,46.25 36.13,47.67 43.96,47.63 44.96,48.88 44.96,54.48 v43.33,54.58 | v43.55,64.38 41.54,64.25 41.13,63.84 IC5.16
  Bottom 0.305: v43.33,54.58 43.33,64.21 v43.55,64.38
CAN_SDO  (via drill 0.6)
  Top 0.305: IC2.15 33.62,46.55 v34.35,47.45 | v41.8,61.1 41.73,62.75 IC5.15
  Bottom 0.305: v34.35,47.45 34.44,47.45 34.92,48.87 34.91,50.35 34.42,50.35 34.35,53.81 35.75,55.21 35.75,58.28 36.13,58.53 37.18,58.53 37.89,58.51 41.29,58.6 41.78,60.75 41.81,61.14 v41.8,61.1
CANH  (via drill 0.6)
  Top 0.305: R19.1 7.87,8.21 9.4,9.74 17.7,9.74 19.02,11.06 27.27,11.06 28.53,12.32 28.53,13.92 J2.5 | D2.1 13.76,13.91 12.83,14.84 11.04,14.84 IC3.7 22.05,14.94 v22.7,15.59
  Bottom 0.305: v22.7,15.59 23.63,15.59 24.14,15.09 28.07,15.09 28.51,14.64 28.51,13.98 J2.5
CANL
  Top 0.305: J1.1 13.37,6.39 14.24,7.26 18.47,7.26 18.97,7.76 18.97,9.63 19.52,10.18 28.26,10.18 29.96,11.88 29.96,13.21 29.8,13.37 29.8,14.91 29.47,15.24 28.5,15.24 J2.4 27.38,16.36 27.38,12.44 26.96,12.01 D2.2 14.98,12.11 13.41,12.11 13.09,12.44 13.09,13.15 12.56,13.67 IC3.6
CTS
  Bottom 0.305: J7.6 97.04,63.54 96.35,62.85 93.14,62.85 92.28,61.99 79.01,61.99 77.45,63.55 77.45,65.92 IC8.29
D+  (via drill 0.6)
  Top 0.406: IC8.38 59.54,64.93 68.01,65 68.01,63.41 67.97,56.08 78.34,56.08 78.8,55.62 95.75,55.62 97.81,53.56 97.81,38.74 v94.69,37.14 | v93.82,19.17 93.82,17.97 94.88,16.92 96.04,16.92 J4.D+
  Bottom 0.406: v94.69,37.14 94.69,22.79 93.73,20.31 93.73,19.26 v93.82,19.17
D-  (via drill 0.6)
  Top 0.406: J4.D- 97.38,19.33 v96.16,20.45 | v96.16,50.53 96.16,51.59 92.86,54.88 66.99,54.88 66.97,63.33 66.97,64.24 57.63,64.24 57.63,65.98 IC8.39
  Bottom 0.406: v96.16,20.45 96.21,50.35 v96.16,50.53
DATA_433  (via drill 0.6)
  Top 0.305: v36.3,53.48 36.3,54.17 36.6,54.47 36.6,55.66 IC5.6
  Bottom 0.305: JP2.2 32.15,40.77 34.15,42.76 34.15,44.55 36,46.4 36,53.17 v36.3,53.48
DTR
  Bottom 0.305: J7.7 96.81,66.08 96.51,65.78 96.51,64.54 96.03,64.06 91.96,64.06 91.61,63.71 91.61,63.1 91.36,62.85 83.37,62.85 83.18,63.04 83.18,65.64 IC8.26
GND  (via drill 0.6)
  Top 0.203: C7.2 86.36,63.5 82.55,63.5 82.55,67.31 85.09,69.85 87.63,69.85 R5.2
  Top 0.305: C15.2 31.74,66.01 v31.4,66.8 | v23.67,27.24 23.67,28.87 C9.1 | v44.17,27.05 44.72,28.7 C8.1 | v40.91,35.58 39.81,35.58 IC2.9 | v41.84,66.48 40.84,65.43 40.84,65.46 39.7,65.46 C12.1 | D2.3 19,12.96 v19.08,13.04 | IC3.8 12.94,16.21 v12.98,16.17 | IC3.2 3.74,14.94 v4.13,14.94 | v26.93,42.61 26.93,44.54 C10.1 | J3.6 80.47,27.43 C27.2 80.25,29.86 C26.2 80.22,30.02 v82.04,30.02 | v98.69,14.51 98.69,16.94 J4.GND | v103.64,26.68 105.29,26.68 C25.2 | v90.01,63.8 91.62,63.8 C6.2 | C24.2 86.08,63.81 C7.2 84.43,63.83 v84.35,63.75
  Top 0.406: v20.64,65.75 20.73,65.67 C18.2 18.61,63.94 R12.1 | C17.2 19.8,60.95 v20.35,60.4 | v16.35,65.72 14.39,65.73 IC4.7 | R14.1 v6.09,59.05 | R14.1 | D5.A 18.95,50.01 v18.97,50.02 | C20.- 23.2,53.25 v23.27,53.33 | v23.18,56.95 21.27,56.95 C19.- | v18.09,45.23 16.89,45.23 C3.2 15.29,44.77 15.29,43.08 14.67,42.47 IC1.7 | R2.1 C2.2 v20.23,42.53 | C4.- 20.24,36.05 C5.- 22.17,32.69 v22.27,32.79 | D1.A 20.48,29.74 v20.51,29.71 | v7.7,36.42 6.3,36.42 R4.1 | 34.23,51.08 33.79,51.08 C11.1 | 34.23,51.08 C13.1 | v33.96,49.44 34.13,50.99 34.23,51.08 | v42.02,52.89 42.02,51.71 C14.1 42.4,51.33 X1.2 40.17,51.13 X1.4 | IC5.8 37.88,57.51 v37.85,57.54 | v39.25,61.1 39.16,62.54 IC5.19 | C23.2 29.04,52.79 v29.39,52.44 | C22.2 52.82,25.49 C21.2 55.21,25.49 55.74,24.96 55.74,23.97 v55.65,23.88 | v86.04,70.36 87.91,69.91 R5.2 | IC7.3 74.6,40.81 75.38,40.03 75.38,38.84 | 75.38,38.84 C29.2 | IC6.3 74.09,48.52 74.7,47.91 74.7,46.36 | 74.7,46.36 C28.2 | 75.38,38.84 76.66,38.84 v76.88,38.62 | 74.7,46.36 76.4,46.36 v76.45,46.41
  other vias: 48.32,63.24 49.51,63.32 50.75,63.31 52.01,63.31 53.23,63.28 54.47,63.29 55.73,63.26 56.99,63.24 58.26,63.24 59.52,63.24 60.77,63.24 62.03,63.21 63.25,62.97 63.29,61.75 63.27,60.51 63.31,59.26 63.29,58.04 63.34,56.76 63.38,55.52 63.39,54.29 63.38,53.07 63.36,51.82 63.41,50.55 63.45,49.22 63.45,47.96 63.45,46.63 63.45,45.27 63.45,43.92 63.45,42.55 63.45,41.27 63.45,39.94 63.41,38.62 63.37,37.29 63.32,35.84 53.63,34.14 52.38,34.17 51.23,34.2 49.99,34.24 48.79,34.27 47.54,35.71 47.57,37 47.56,38.23 47.58,39.46 47.57,40.69 47.53,41.94 47.53,43.19 47.48,44.42 47.46,45.66 47.41,46.94 47.4,48.22 47.4,49.53 47.41,50.9 47.44,52.23 47.47,53.5 47.46,54.76 47.44,56.01 47.47,57.29 47.5,58.54 47.5,59.78 47.5,61.04 47.49,62.29 47.53,34.39
  pour Bottom: -0.89,72.68 -1.4,72.68 -0.81,-1.16 111.17,-0.39 111.17,72.41 112.34,72.41
  pour Top: -1.25,72.36 -2.05,72.36 -2.05,-2.23 110.48,-2.23 110.48,-1.6 110.66,-1.6 110.66,72.9
ID48IO-1  (via drill 0.6)
  Top 0.305: IC6.1 68.66,46.37 67.9,47.13 67.9,50.15 68.61,50.87 72.44,50.87 73.15,51.58 73.15,53.44 v73.06,53.53 | v35.65,60.01 35.3,60.01 35.3,61.32 35.29,63.06 IC5.25
  Bottom 0.305: v73.06,53.53 73.06,59.58 72.17,60.47 72.17,65.08 72.54,65.58 72.54,69.47 72.26,69.89 45.15,69.89 44.61,69.36 44.61,67.63 43.96,66.98 43.16,66.98 42.92,66.74 42.92,65.85 42.62,65.55 40.69,65.55 40.22,65.07 35.7,65.07 35.25,64.63 35.25,64.27 v35.65,60.01
ID48IO-2  (via drill 0.6)
  Top 0.305: IC7.1 68.83,39.54 68.31,40.05 68.31,42.21 69.3,43.2 70.74,43.2 72.08,44.54 76.31,44.54 77.72,45.95 77.72,50.95 v75.1,53.58 | v74.43,57.67 71.33,57.67 71.14,57.86 71.14,64.7 70.59,65.25 70.59,69.63 70.39,69.83 47.53,69.83 47.51,69.8 47.51,68.91 v47.48,68.89 | v45.87,59.2 39.75,59.2 v39.23,59.72 | v37.05,59.7 37.05,60.42 36.19,61.28 35.97,61.28 35.97,62.89 IC5.24
  Bottom 0.305: v75.1,53.58 75.1,57 v74.43,57.67 | v47.48,68.89 47.48,66.56 45.35,64.43 45.35,59.72 v45.87,59.2 | v39.23,59.72 37.08,59.72 v37.05,59.7
N$1
  Top 0.406: IC1.3 5.95,41.2 5.36,41.64 5.36,45.09 R1.2
N$2
  Top 0.406: C1.1 3.72,45.22 R1.1
N$3
  Top 0.406: C1.2 4.81,41.02 5.77,40.06 5.77,38.85 R4.2 7,39.93 IC1.4 8.23,38.57 R3.1
N$4
  Top 0.406: IC1.6 15.25,41.2 C2.1 R2.2
N$5
  Top 0.406: 13.47,44.73 IC1.8 | 13.47,44.73 14.24,45.5 14.24,47.5 | 14.24,47.5 Z2.A | 14.24,47.5 16.79,47.5 16.82,47.54 16.35,47.54 C3.1 | 13.47,44.73 13.47,43.85 13.58,43.74 11.49,43.74 11.22,43.47 11.22,40.44 11.71,39.95 13.42,39.95 IC1.5
N$6  (via drill 0.6)
  Top 0.406: D1.C 15.05,28.05 14.24,27.24 7.5,27.24 L2.1 4.01,30.72 v4.01,33.89 | IC1.1 6.98,43.74 v6.39,43.55
  Bottom 0.406: v6.39,43.55 6.54,42.04 4.12,39.62 4.12,34 v4.01,33.89
N$7
  Top 0.305: J5.1 100.2,19.23 R6.1
N$8
  Top 0.305: J4.VUSB 108.2,17 109.19,17.99 109.19,22.31 J6.3 107.34,26.59 C25.1
N$9
  Top 0.305: IC2.8 38.52,32.94 39.13,32.33 Q1.P$1 44.76,30.99 C8.2
N$10
  Top 0.305: C9.2 23.79,30.99 Q1.P$2 29.64,31 29.64,32.24 30.57,33.16 36.87,33.16 37.25,33.55 IC2.7
N$11
  Top 0.305: R19.2 12.23,3.99 12.87,3.36 14.9,3.36 15.89,4.35 15.89,5.59 J1.2
N$12
  Top 0.305: R22.1 104.45,34 D4.2
N$13
  Top 0.406: R23.1 27.12,56.34 R24.2 C23.1
N$16
  Top 0.305: R21.1 D3.2
N$17
  Top 0.406: IC4.3 6.34,64.06 5.6,64.79 R11.2
N$18
  Top 0.813: R11.1 3.7,65.64 C16.1
N$19
  Top 0.406: C16.2 4.71,62.64 R14.2 6.24,62.78 IC4.4 8.5,62.5 R13.1
N$20  (via drill 0.6)
  Top 0.406: R12.2 IC4.6 | R12.2 | C17.1 14.23,60.95 v13.97,61.22 | v17.73,65.73 17.43,65.18 R12.2
  Bottom 0.406: v13.97,61.22 13.97,63.52 14.5,64.06 16.66,64.06 | 16.66,64.06 17.18,64.82 17.77,65.72 | 16.66,64.06 16.77,64.19 v17.73,65.73
N$21
  Top 0.406: IC4.8 12.44,66.59 11.9,66.05 11.9,63.41 12.54,62.77 13.97,62.77 IC4.5 15.18,62.78 15.45,62.52 20.45,62.52 C18.1
  Top 0.813: IC4.8 15.32,66.59 16,67.27 16,69.37 Z1.A
N$22  (via drill 0.6)
  Top 0.406: IC4.1 7.47,66.59 v6.81,65.94 | v4.61,57.3 4.61,54.05 L1.1 8.65,50.01 D5.C
  Bottom 0.406: v6.81,65.94 5.57,65.94 4.48,64.85 4.48,57.43 v4.61,57.3
N$27
  Top 0.406: R16.1 59.26,25.49 C21.1 R15.1
N$28
  Top 0.305: IC8.18 89.58,34.62 90.43,35.48 97.99,35.48 98.59,36.07 99.23,36.07 99.5,36.35 99.5,38.52 R21.2
N$29
  Top 0.305: IC8.20 99.76,34.04 R22.2
N$30
  Top 0.406: D6.2 89.84,69.84 R5.1
N$31
  Top 0.406: L3.2 48.6,27.36 R17.2 48.66,25.46 C22.1 | J8.4 50.59,25.16 C22.1 | C22.1 50.89,27.82 R18.2
N$35
  Bottom 0.406: J5.2 104.95,20.27 103.58,21.64 100.92,21.64 100.01,22.56 100.01,49.06 97.17,51.91 65.35,51.83 65.31,58.72 65.33,62.51 65.33,64.22 55.51,64.22 55.51,65.94 55.48,65.94 IC8.40
OSC1
  Top 0.305: IC5.9 38.55,55.66 38.55,54.7 38.34,54.49 R20.2 38.43,53.53 X1.3 38.24,51.04 C13.2
OSC2
  Top 0.203: C14.2 43.18,49.53 44.45,50.8 44.34,52.04 41.8,54.58 39.37,54.61 39.34,54.58
  Top 0.305: X1.1 43.04,49.19 43.07,49.17 42.66,49.17 C14.2 | R20.1 40.24,53.69 39.34,54.58 39.22,54.7 39.22,55.64 IC5.10
PGC  (via drill 0.6)
  Top 0.305: IC5.27 33.98,61.33 33.81,61.16 32.19,61.16 v32.13,61.23
  Bottom 0.305: v32.13,61.23 33.59,61.23 34.03,61.67 34.03,65.56 34.23,65.75 39.35,65.75 40.52,66.92 40.52,68.44 JP4.5
PGD  (via drill 0.6)
  Top 0.305: IC5.28 32.24,62.93 v32.16,62.85
  Bottom 0.305: v32.16,62.85 32.16,65.87 33.37,67.08 37.73,67.08 37.98,67.34 37.98,68.44 JP4.4
PIC_RESET  (via drill 0.6)
  Top 0.406: IC5.1 32.69,56.32 R24.1 29.76,56.32 30.34,56.9 v30.34,63.36
  Bottom 0.406: v30.34,63.36 30.34,68.45 JP4.1
RI
  Bottom 0.305: J7.8 96.33,68.62 95.75,68.04 95.75,65.56 95.2,65.01 87.86,65.01 87.51,65.36 87.51,65.97 IC8.24
RTS  (via drill 0.6)
  Top 0.305: v79.59,56.93 IC8.28
  Bottom 0.305: J7.2 83.14,53.38 v79.59,56.93
RXCAN  (via drill 0.6)
  Top 0.305: IC3.4 7.48,12.4 7.84,12.76 7.84,21.09 10.88,25.35 26.85,25.45 v27.95,27.59 | v28.66,33.77 30.25,33.77 30.88,34.4 30.88,35.54 IC2.2
  Bottom 0.305: v27.95,27.59 27.95,33.05 v28.66,33.77
RXD
  Bottom 0.305: J7.4 75.99,58.46 73.48,60.97 73.48,65.94 IC8.31
RXD2
  Top 0.305: IC8.35 65.58,66.65 64.86,67.37 54.65,67.37 46.05,67.28 44.65,65.01 44.6,59.91 41.05,59.87 40.4,60.27 40.4,62.85 IC5.17
SPI_CLK  (via drill 0.6)
  Top 0.305: J3.5 79.37,25.78 v79.41,25.82
  Bottom 0.305: v79.41,25.82 79.41,30.66 80.29,31.54 80.86,31.54 81.66,32.34 81.66,33.96 IC8.14
SPI_DIN
  Top 0.305: J3.7 81.57,25.76 82.31,26.5 82.31,27 83.8,28.49 83.8,32.15 84.14,32.5 85.14,32.5 85.56,32.92 85.56,34.02 IC8.16
SPI_DOUT
  Top 0.305: J3.3 77.17,32.09 77.92,32.84 82.38,32.84 IC8.15
SPI_EN
  Top 0.305: J3.2 76.07,32.98 76.58,33.49 76.58,34.79 77.04,35.25 79.1,35.25 79.6,34.75 79.6,34.06 IC8.13
TPIN+
  Top 0.305: J8.3 49.32,17.21 49.84,16.69 56.44,16.69 56.95,17.2 56.95,18.89 56.53,19.3 56.12,19.3 55.71,19.72 55.71,21.69 56.21,22.19 60.79,22.19 61.3,22.7 61.3,25.35 R16.2
  Top 0.406: IC8.2 57.58,31.69 57.92,31.34 60.16,31.34 61.3,30.2 61.3,25.5 R16.2
TPIN-  (via drill 0.6)
  Top 0.406: IC8.3 59.58,32.41 59.87,32.12 61.59,32.12 62.01,31.7 62.01,30.92 62.36,30.57 62.36,29.75 v62.34,29.73 | v59.23,29.71 57.1,29.71 R15.2 | J8.6 53.22,18.09 53.27,18.05 53.27,21.69 53.49,21.91 54.61,21.91 55.61,22.91 58.83,22.91 v59.36,23.44
  Bottom 0.406: v62.34,29.73 59.25,29.73 v59.23,29.71 59.36,29.58 v59.36,23.44
TPOUT+  (via drill 0.6)
  Top 0.406: J8.1 46.78,25.44 | 46.78,25.44 R17.1 | 46.78,25.44 46.78,27.35 v47.19,27.77
  Bottom 0.406: v47.19,27.77 47.19,31.03 48.73,31.78 61.12,31.78 61.7,33.16 61.7,33.91 IC8.4
TPOUT-  (via drill 0.6)
  Top 0.406: J8.2 48.05,22.11 v48.85,22.91 | v54.41,27.83 R18.1
  Bottom 0.406: v48.85,22.91 53.77,22.91 54.35,23.48 54.35,27.77 v54.41,27.83 54.41,30.42 55.79,30.95 62.94,30.95 63.71,32.56 63.71,33.91 IC8.5
TXCAN  (via drill 0.6)
  Top 0.305: IC3.1 5.75,20.18 10.32,26.08 25.32,25.99 26.05,26.71 26.05,28.3 v25.97,28.38 | v26.6,35.43 29.5,35.43 IC2.1
  Bottom 0.305: v25.97,28.38 25.97,34.8 v26.6,35.43
TXD
  Bottom 0.305: J7.5 104.43,61 104.4,61.04 77.55,61.04 75.51,63.07 75.51,65.97 IC8.30
TXD2
  Top 0.305: IC8.34 67.51,66.11 67.51,67.87 66.74,68.04 48.45,68.04 48.27,67.86 45.75,67.86 45.55,67.67 44.06,65.39 41.59,65.39 40.8,64.72 39.8,64.69 IC5.18
V+
  Top 0.813: J8.9 60.37,20.63 63,18 63,2 62,1 36,1 | 36,1 4,1 1.2,2.54 1.2,47.85 | 1.2,47.85 1,68.82 3,70 5.57,70 Z1.C | J2.8 J2.6 | J2.8 32.29,15.24 J2.7 | J2.8 35.16,16.54 36.9,14.8 36.9,1.9 36,1 | Z2.C 2.08,48.23 1.2,47.85

### Text on the board
tNames: www.grodansparadis.com | Blitz | rev C